# Altium project MAIN_BOARD.PrjPcb (part 3 of 3)

## Sheet JETSON.SchDoc
size E; SheetNumber: 4; SheetTotal: 10
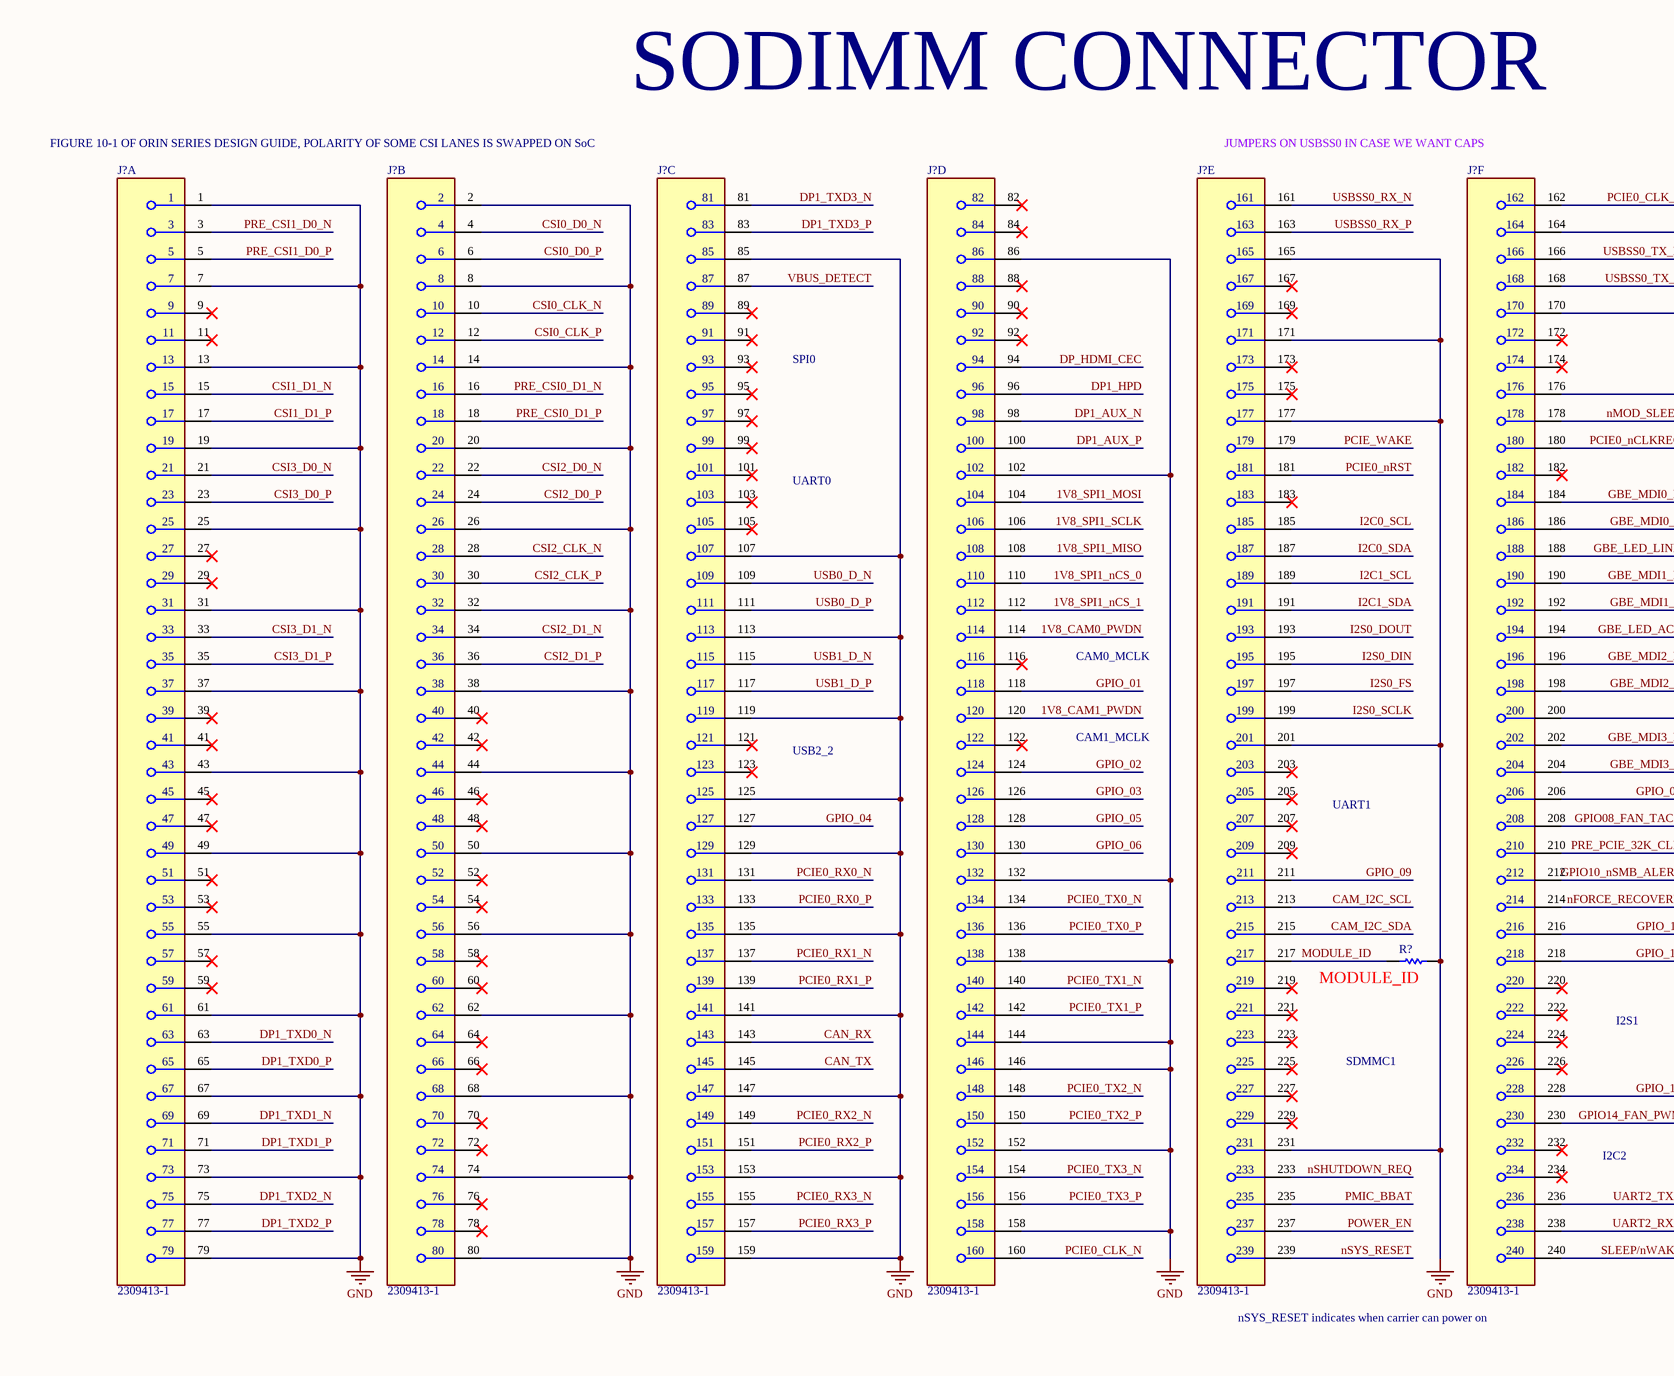
[diagram p20: JETSON.SchDoc, top left]
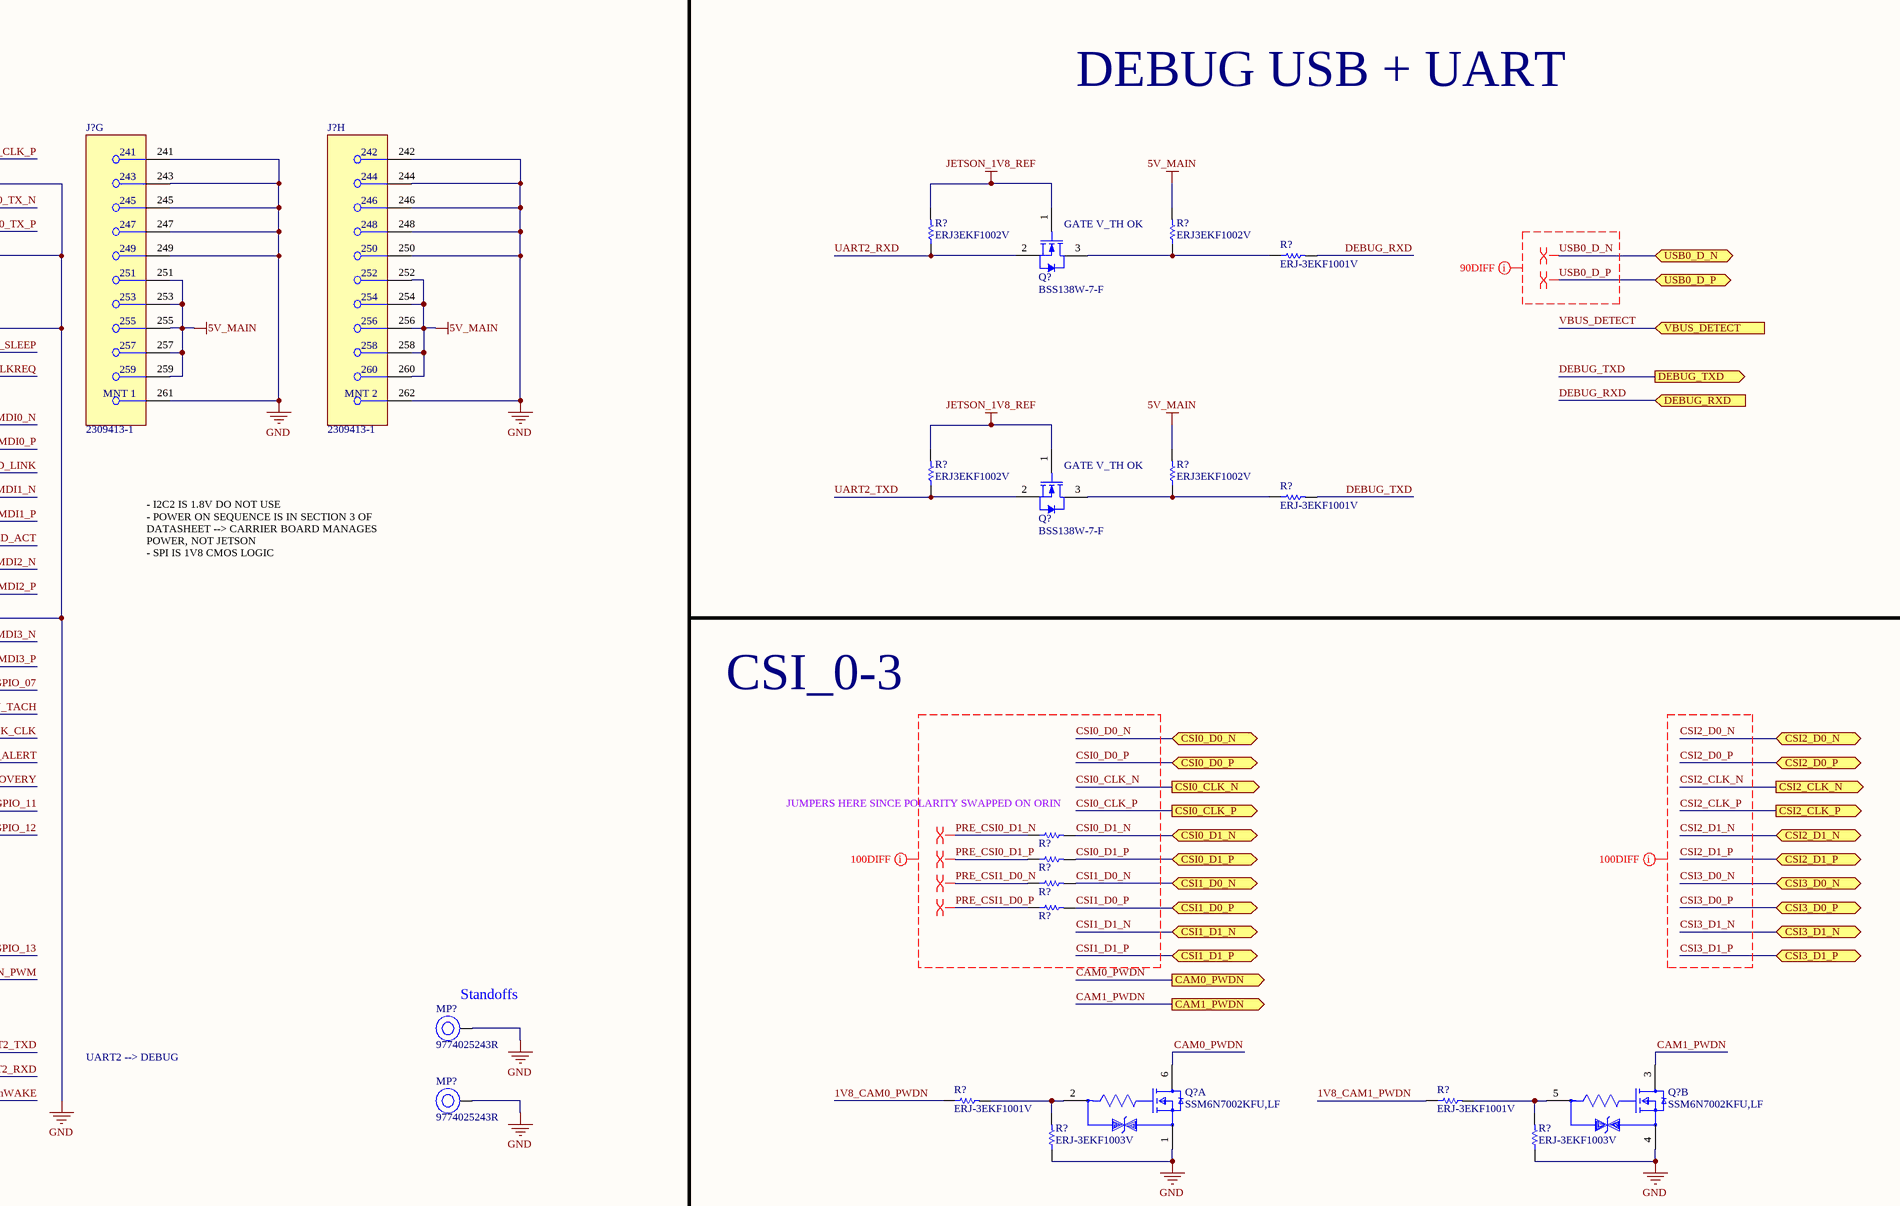
[diagram p21: JETSON.SchDoc, top middle]
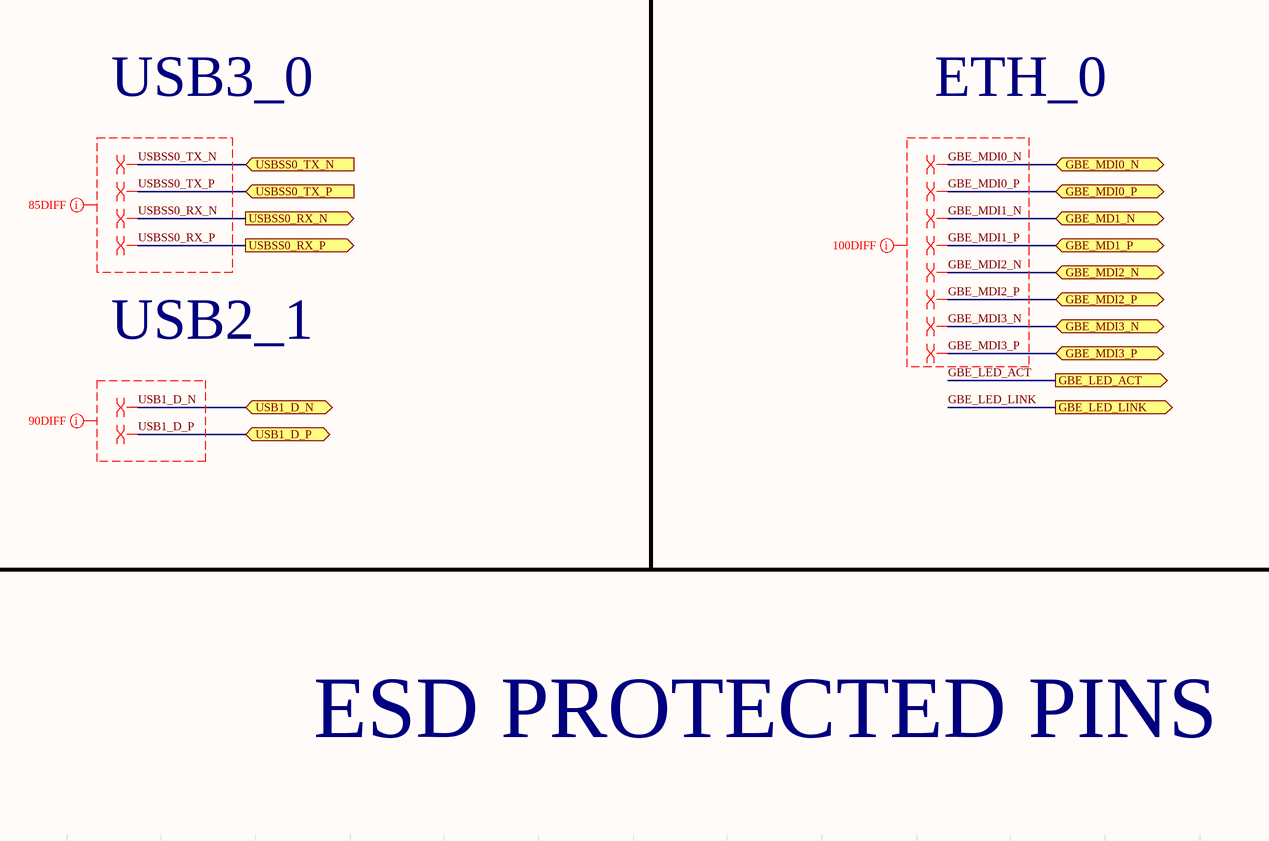
[diagram p22: JETSON.SchDoc, top right]
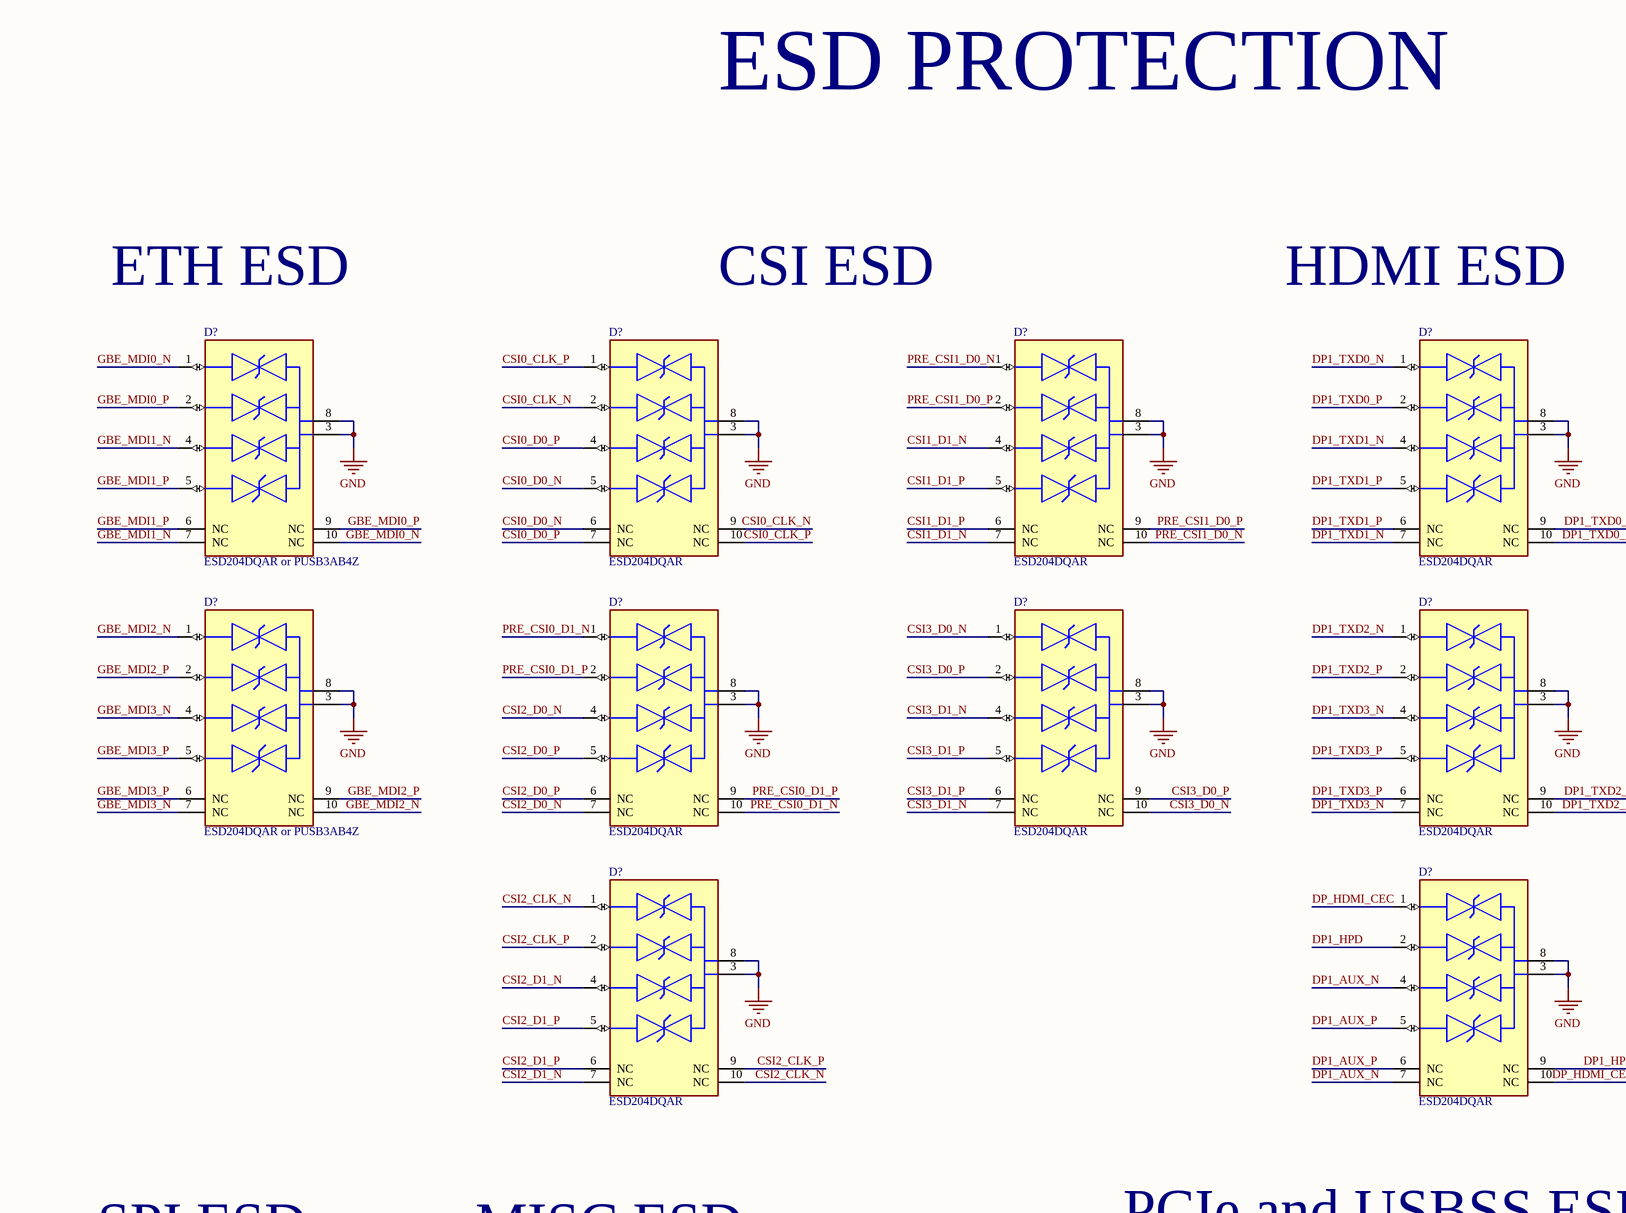
[diagram p23: JETSON.SchDoc, centre left]
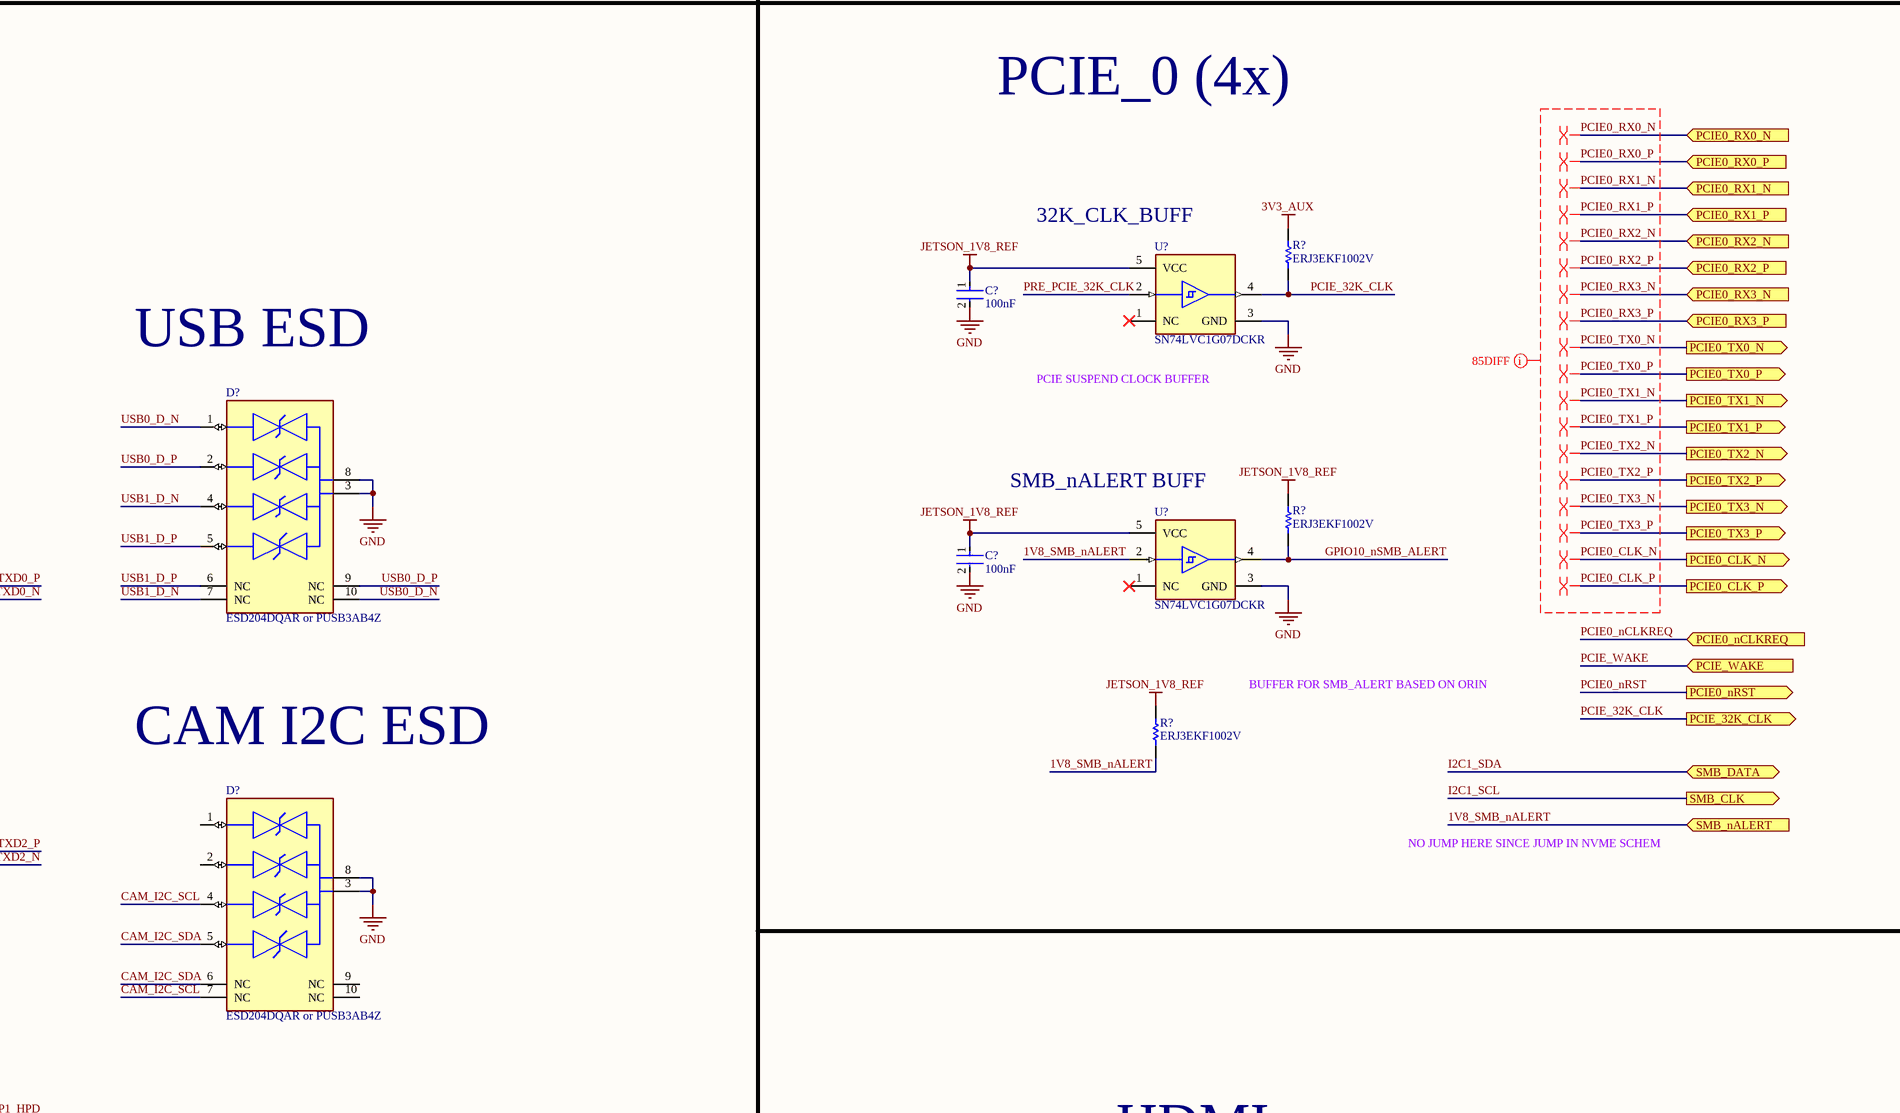
[diagram p24: JETSON.SchDoc, centre middle]
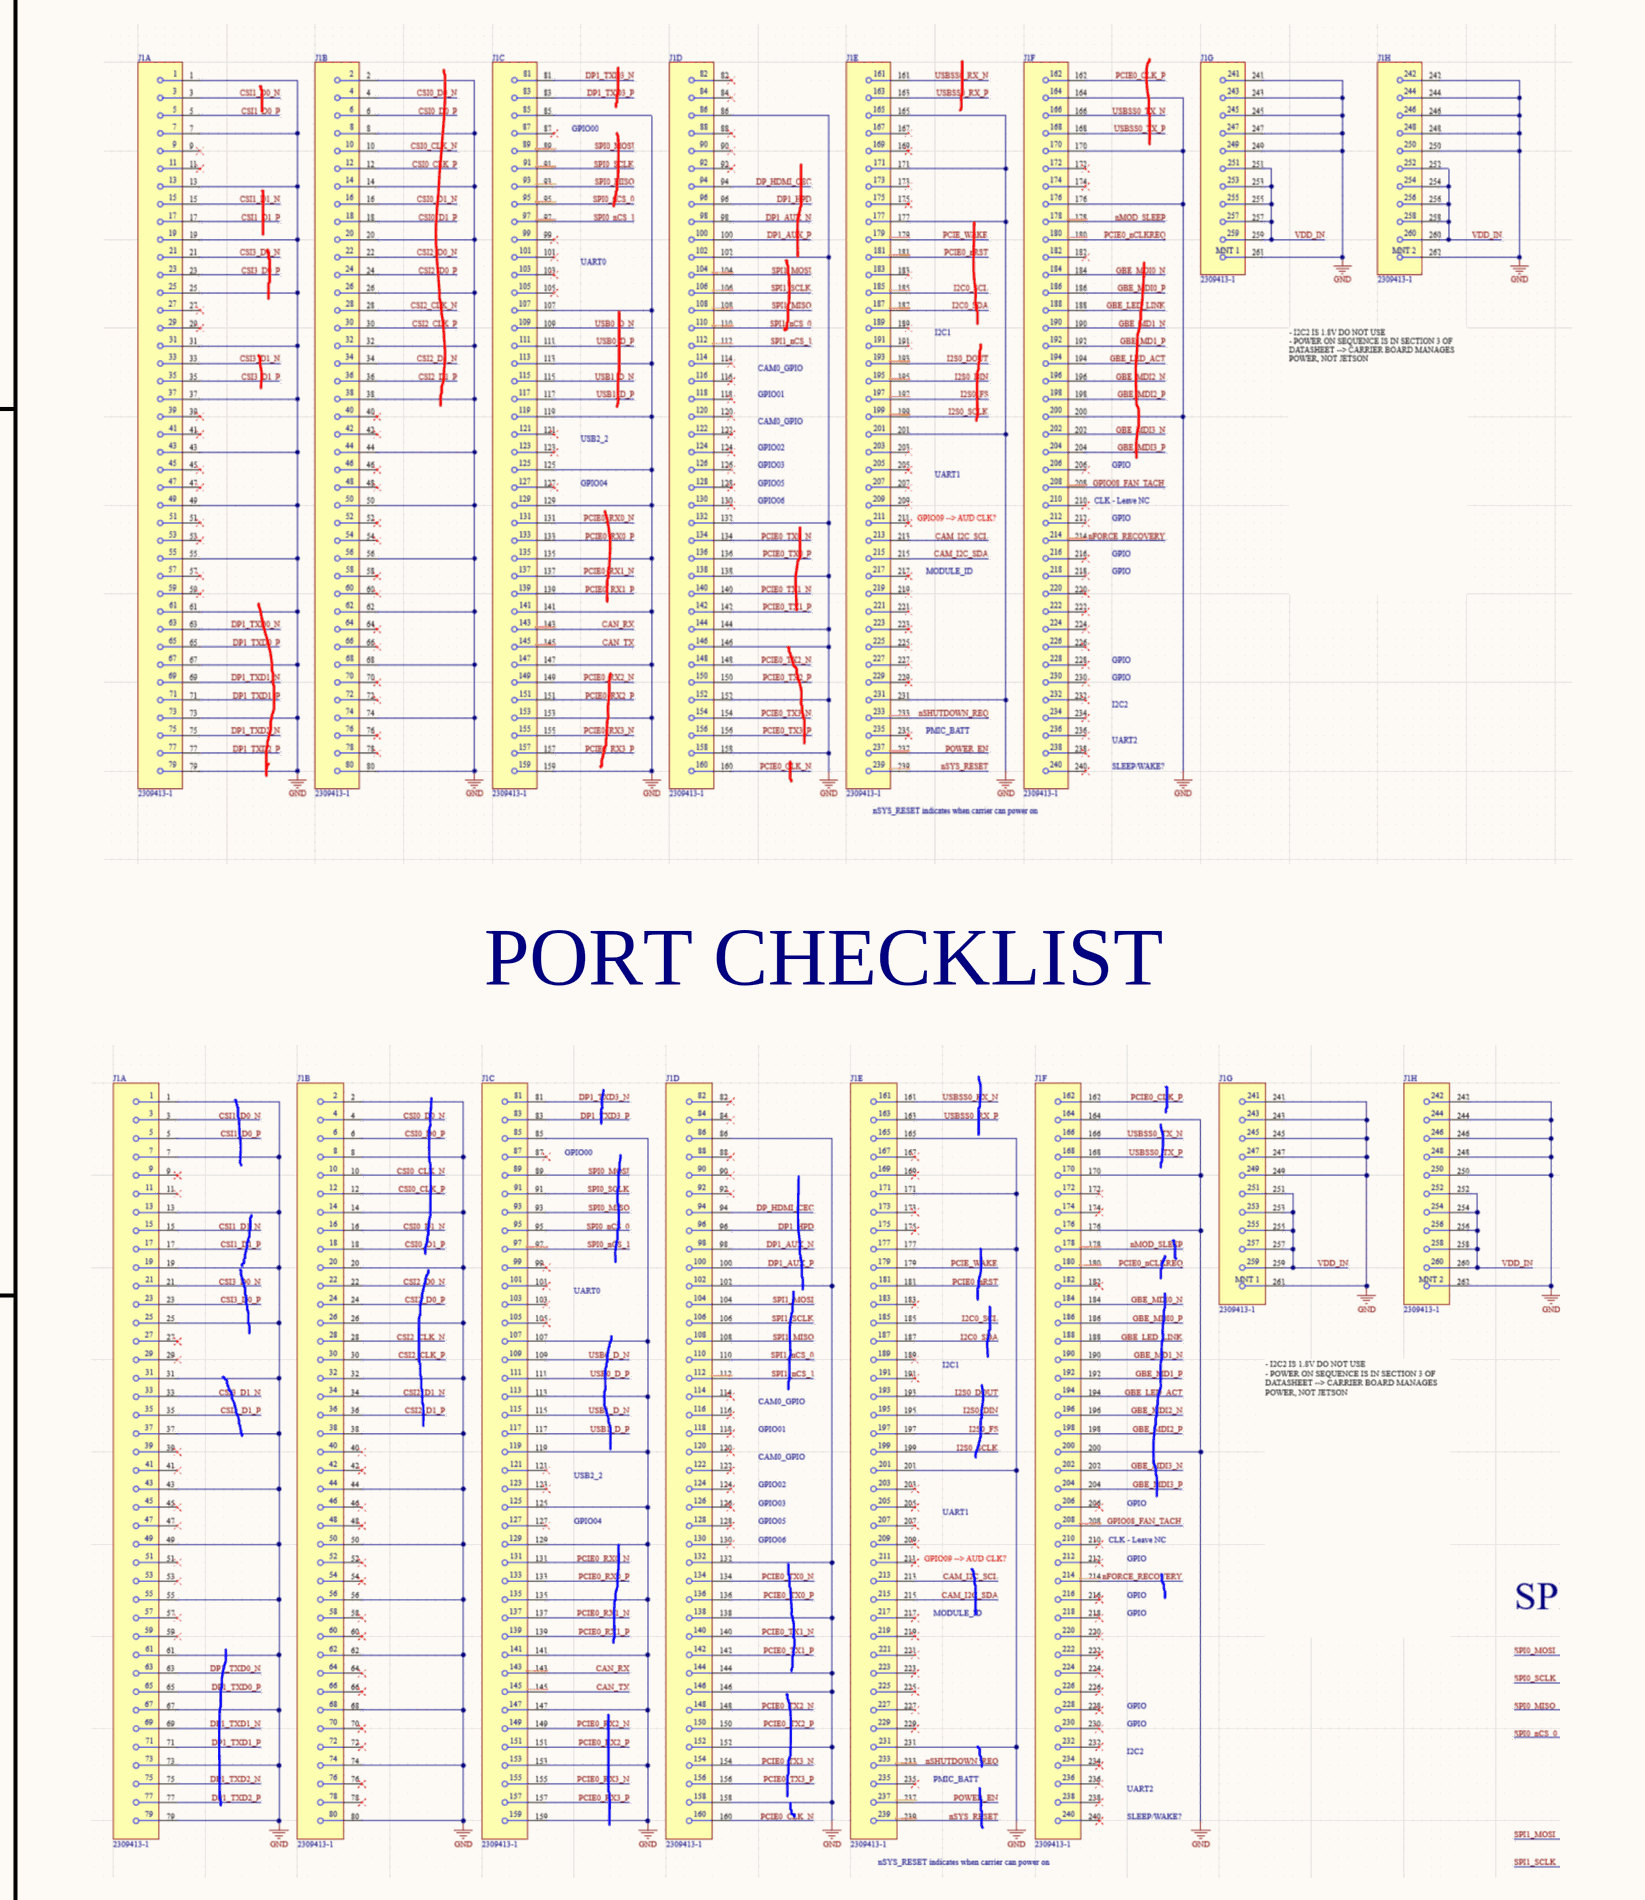
[diagram p25: JETSON.SchDoc, centre right]
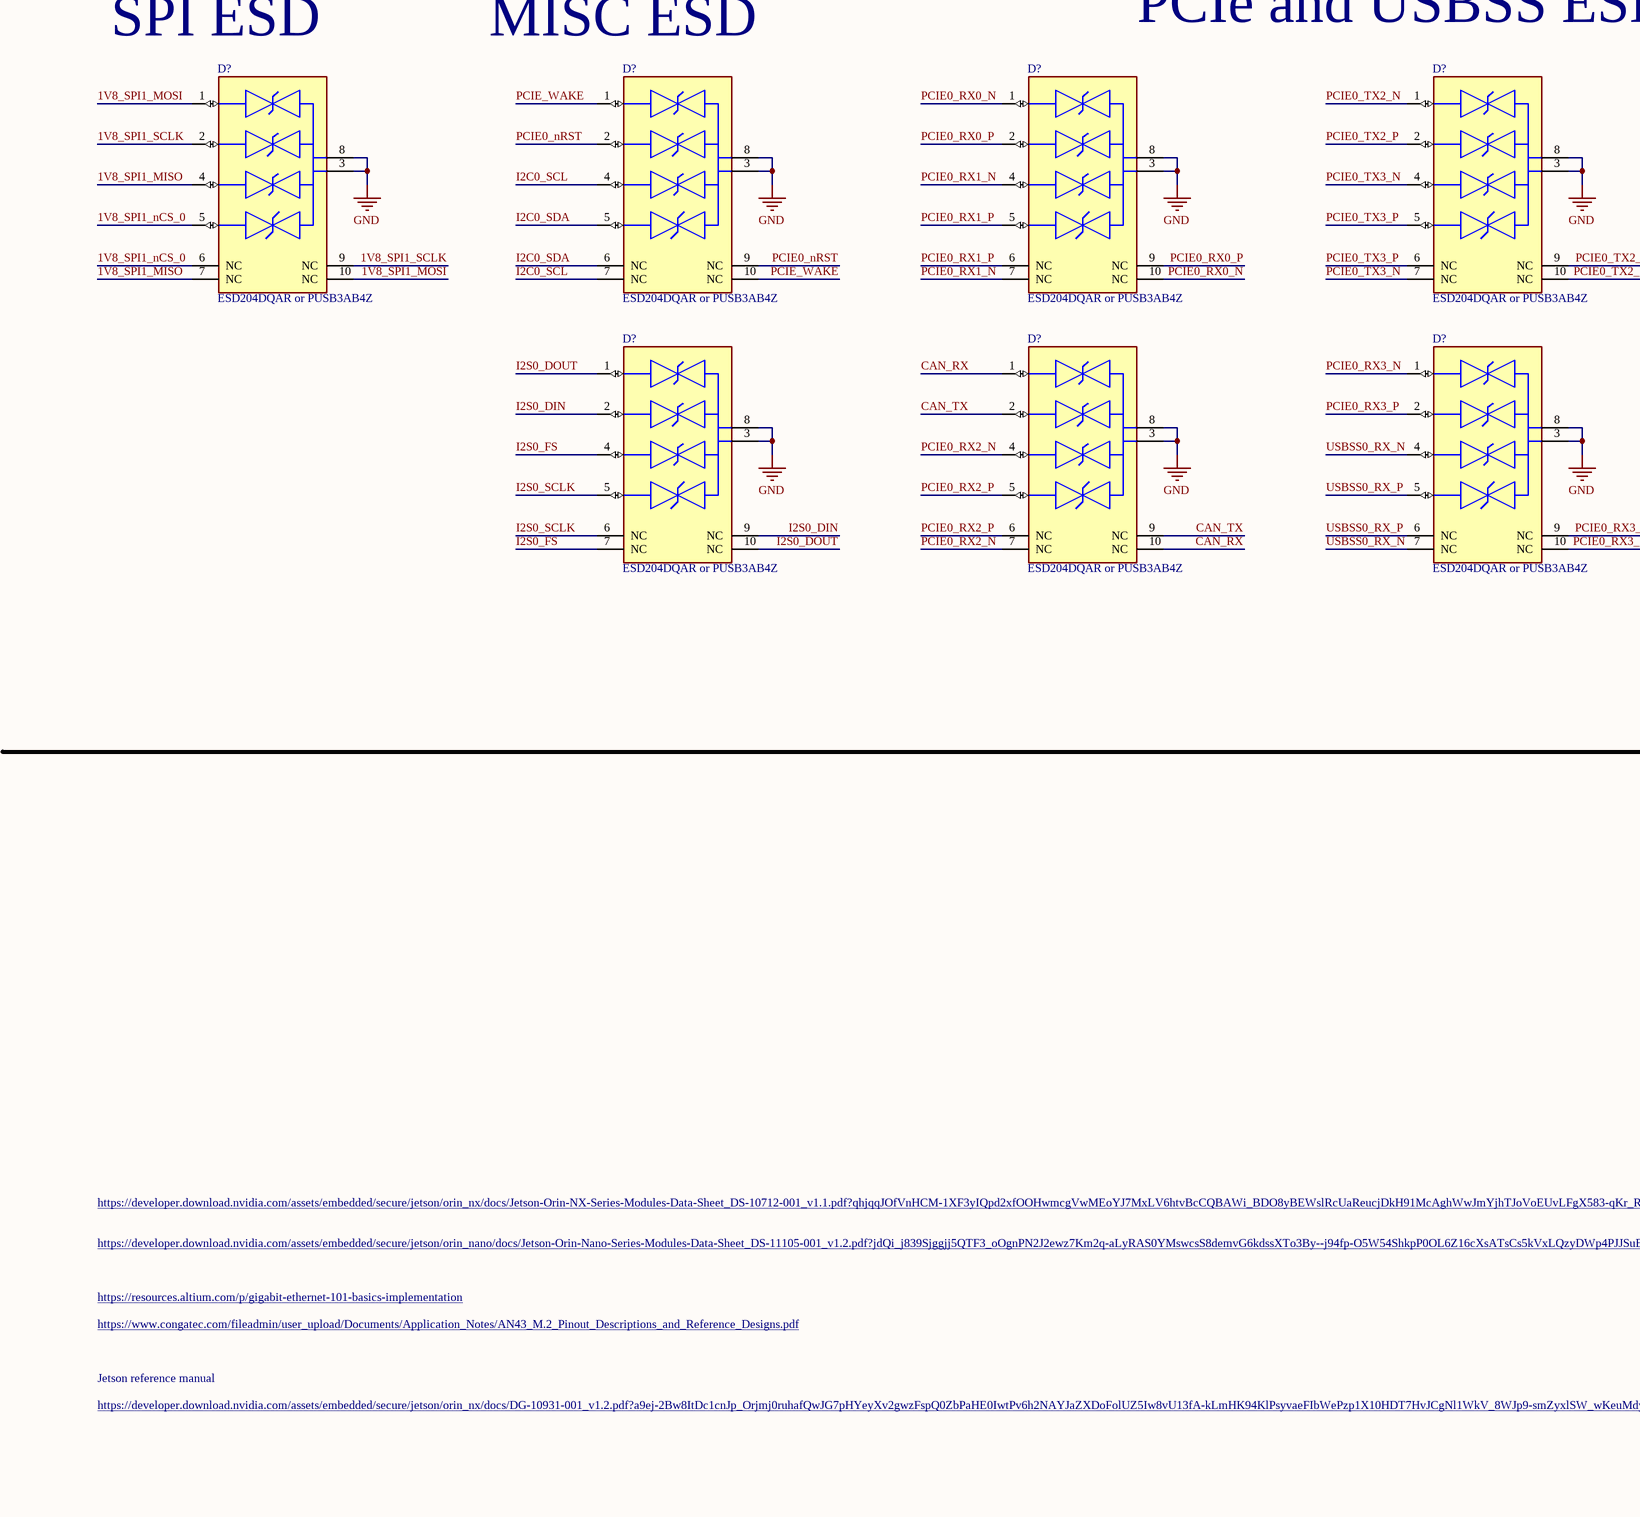
[diagram p26: JETSON.SchDoc, bottom left]
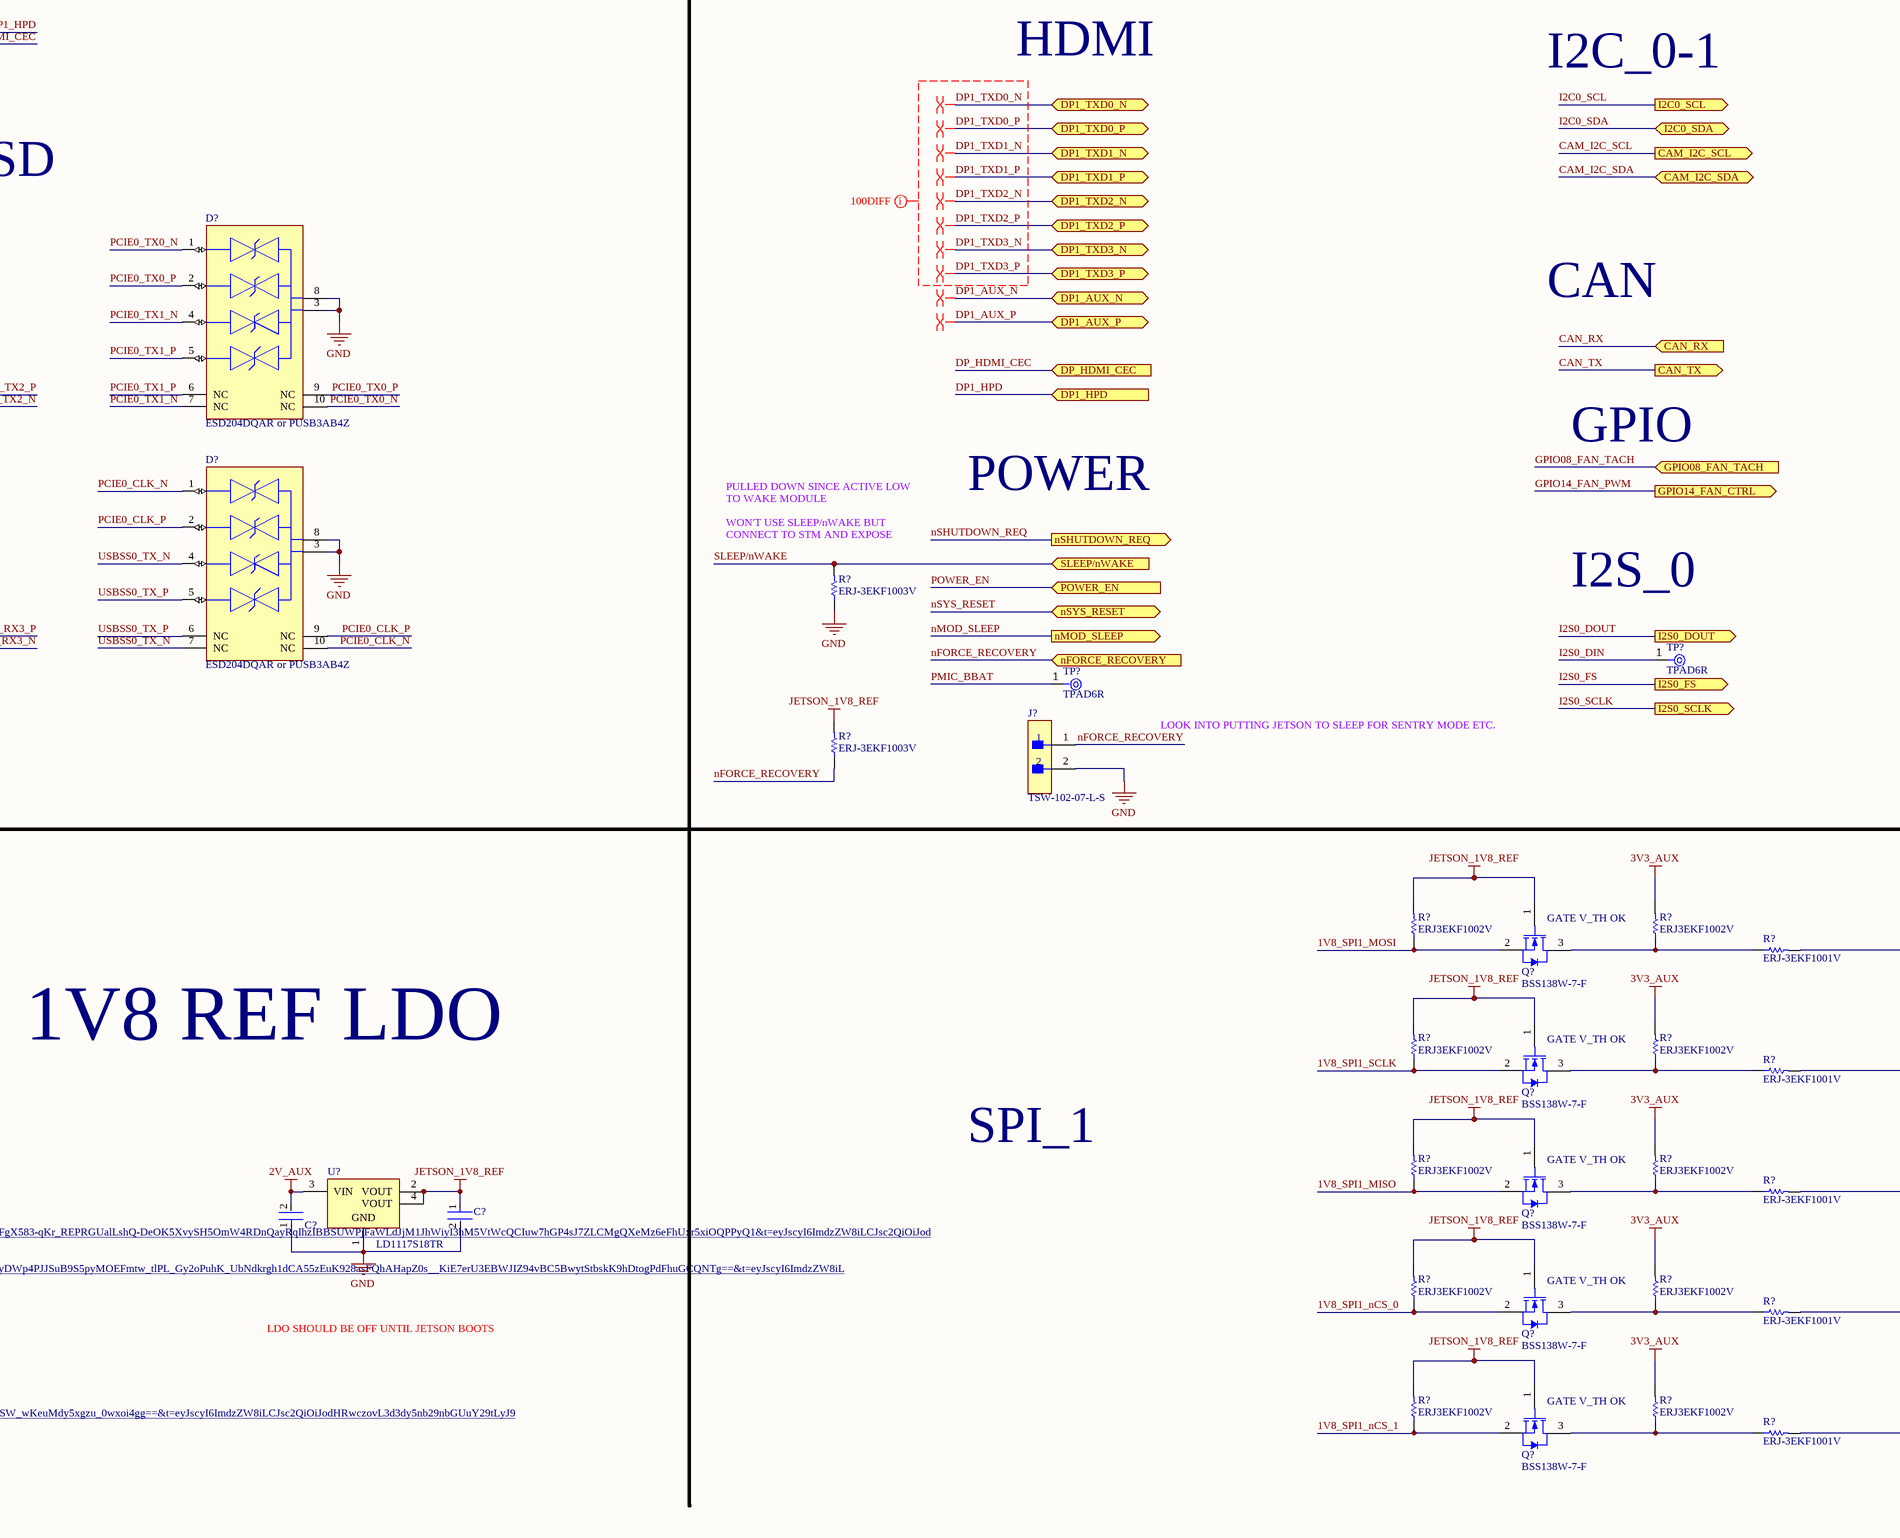
[diagram p27: JETSON.SchDoc, bottom middle]
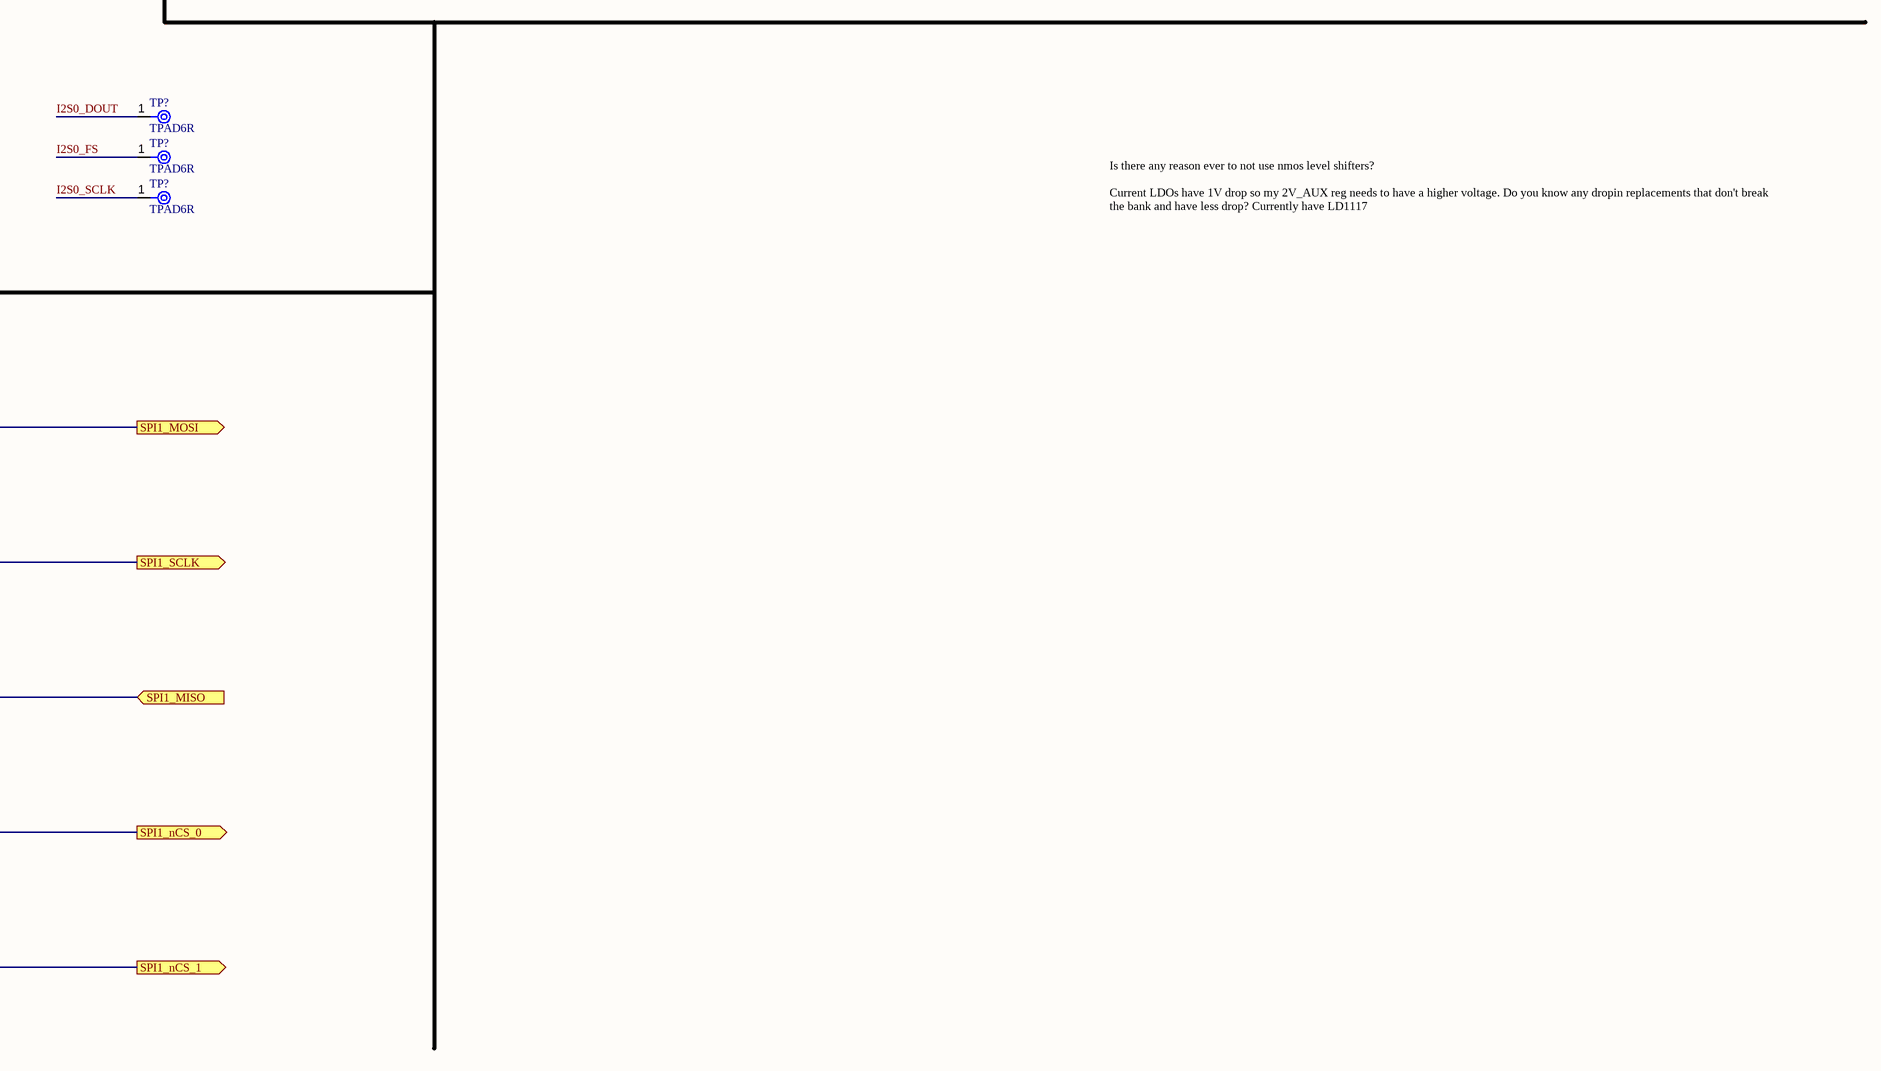
[diagram p28: JETSON.SchDoc, bottom right]

### Parts
(Parts that share a designator on the sheet are numbered #1, #2 ... from top to bottom, then left to right.)
C?#69  100nF  [FP-0402-L_1_0_0_05-W_0_5-IPC_A]
C?#70  100nF  [FP-0402-L_1_0_0_05-W_0_5-IPC_A]
C?#71  GRM188R60J106ME47D  [FP-GRM188-0_1-e0_2_0_55-IPC_A]  (value not drawn)
C?#72  C1005X7R1H104K050BB  [FP-C1005-050-0_05-IPC_C]  (value not drawn)
D?#3  ESD204DQAR or PUSB3AB4Z  [FP-DQA0010A-MFG]
D?#4  ESD204DQAR  [FP-DQA0010A-MFG]
D?#5  ESD204DQAR  [FP-DQA0010A-MFG]
D?#6  ESD204DQAR  [FP-DQA0010A-MFG]
D?#7  ESD204DQAR or PUSB3AB4Z  [FP-DQA0010A-MFG]
D?#8  ESD204DQAR or PUSB3AB4Z  [FP-DQA0010A-MFG]
D?#9  ESD204DQAR  [FP-DQA0010A-MFG]
D?#10  ESD204DQAR  [FP-DQA0010A-MFG]
D?#11  ESD204DQAR  [FP-DQA0010A-MFG]
D?#12  ESD204DQAR or PUSB3AB4Z  [FP-DQA0010A-MFG]
D?#13  ESD204DQAR  [FP-DQA0010A-MFG]
D?#14  ESD204DQAR  [FP-DQA0010A-MFG]
D?#15  ESD204DQAR or PUSB3AB4Z  [FP-DQA0010A-MFG]
D?#16  ESD204DQAR or PUSB3AB4Z  [FP-DQA0010A-MFG]
D?#17  ESD204DQAR or PUSB3AB4Z  [FP-DQA0010A-MFG]
D?#18  ESD204DQAR or PUSB3AB4Z  [FP-DQA0010A-MFG]
D?#19  ESD204DQAR or PUSB3AB4Z  [FP-DQA0010A-MFG]
D?#20  ESD204DQAR or PUSB3AB4Z  [FP-DQA0010A-MFG]
D?#21  ESD204DQAR or PUSB3AB4Z  [FP-DQA0010A-MFG]
D?#22  ESD204DQAR or PUSB3AB4Z  [FP-DQA0010A-MFG]
D?#23  ESD204DQAR or PUSB3AB4Z  [FP-DQA0010A-MFG]
J?#16  2309413-1  [FP-2309413-1-MFG]  (part A of 8)
J?#17  2309413-1  [FP-2309413-1-MFG]  (part B of 8)
J?#18  2309413-1  [FP-2309413-1-MFG]  (part C of 8)
J?#19  2309413-1  [FP-2309413-1-MFG]  (part D of 8)
J?#20  2309413-1  [FP-2309413-1-MFG]  (part E of 8)
J?#21  2309413-1  [FP-2309413-1-MFG]  (part F of 8)
J?#22  2309413-1  [FP-2309413-1-MFG]  (part G of 8)
J?#23  2309413-1  [FP-2309413-1-MFG]  (part H of 8)
J?#24  TSW-102-07-L-S  [FP-TSW-102-07-L-S-MFG]
MP?#4  9774025243R  [9774025243]
MP?#5  9774025243R  [9774025243]
Q?#6  BSS138W-7-F  [DIOD-SOT323-3_V]
Q?#7  BSS138W-7-F  [DIOD-SOT323-3_V]
Q?#8  SSM6N7002KFU,LF  [FP-SSOP6-P-0_65A-MFG]  (part A of 2)
Q?#9  SSM6N7002KFU,LF  [FP-SSOP6-P-0_65A-MFG]  (part B of 2)
Q?#10  BSS138W-7-F  [DIOD-SOT323-3_V]
Q?#11  BSS138W-7-F  [DIOD-SOT323-3_V]
Q?#12  BSS138W-7-F  [DIOD-SOT323-3_V]
Q?#13  BSS138W-7-F  [DIOD-SOT323-3_V]
Q?#14  BSS138W-7-F  [DIOD-SOT323-3_V]
R?#53  ERJ3EKF1002V  [RESC1609X55X30LL15T15]
R?#54  ERJ3EKF1002V  [RESC1609X55X30LL15T15]
R?#55  ERJ-3EKF1001V  [RESC1608X55X30LL15T15]
R?#56  ERJ3EKF1002V  [RESC1609X55X30LL15T15]
R?#57  ERJ3EKF1002V  [RESC1609X55X30LL15T15]
R?#58  ERJ-3EKF1001V  [RESC1608X55X30LL15T15]
R?#59  0402 JUMPER  [RESC1005X40X25ML05T05]  (value not drawn)
R?#60  0402 JUMPER  [RESC1005X40X25ML05T05]  (value not drawn)
R?#61  0402 JUMPER  [RESC1005X40X25ML05T05]  (value not drawn)
R?#62  0402 JUMPER  [RESC1005X40X25ML05T05]  (value not drawn)
R?#63  0402 JUMPER  [RESC1005X40X25ML05T05]  (value not drawn)
R?#64  ERJ-3EKF1001V  [RESC1608X55X30LL15T15]
R?#65  ERJ-3EKF1001V  [RESC1608X55X30LL15T15]
R?#66  ERJ-3EKF1003V  [RESC1608X55X30ML15T15]
R?#67  ERJ-3EKF1003V  [RESC1608X55X30ML15T15]
R?#68  ERJ3EKF1002V  [RESC1609X55X30LL15T15]
R?#69  ERJ3EKF1002V  [RESC1609X55X30LL15T15]
R?#70  ERJ3EKF1002V  [RESC1609X55X30LL15T15]
R?#71  ERJ-3EKF1003V  [RESC1608X55X30ML15T15]
R?#72  ERJ-3EKF1003V  [RESC1608X55X30ML15T15]
R?#73  ERJ3EKF1002V  [RESC1609X55X30LL15T15]
R?#74  ERJ3EKF1002V  [RESC1609X55X30LL15T15]
R?#75  ERJ-3EKF1001V  [RESC1608X55X30LL15T15]
R?#76  ERJ3EKF1002V  [RESC1609X55X30LL15T15]
R?#77  ERJ3EKF1002V  [RESC1609X55X30LL15T15]
R?#78  ERJ-3EKF1001V  [RESC1608X55X30LL15T15]
R?#79  ERJ3EKF1002V  [RESC1609X55X30LL15T15]
R?#80  ERJ3EKF1002V  [RESC1609X55X30LL15T15]
R?#81  ERJ-3EKF1001V  [RESC1608X55X30LL15T15]
R?#82  ERJ3EKF1002V  [RESC1609X55X30LL15T15]
R?#83  ERJ3EKF1002V  [RESC1609X55X30LL15T15]
R?#84  ERJ-3EKF1001V  [RESC1608X55X30LL15T15]
R?#85  ERJ3EKF1002V  [RESC1609X55X30LL15T15]
R?#86  ERJ3EKF1002V  [RESC1609X55X30LL15T15]
R?#87  ERJ-3EKF1001V  [RESC1608X55X30LL15T15]
TP?#4  TPAD6R  [New footprint 1]
TP?#5  TPAD6R  [New footprint 1]
TP?#6  TPAD6R  [New footprint 1]
TP?#7  TPAD6R  [New footprint 1]
TP?#8  TPAD6R  [New footprint 1]
U?#11  SN74LVC1G07DCKR  [FP-DCK0005A-IPC_C]
U?#12  SN74LVC1G07DCKR  [FP-DCK0005A-IPC_C]
U?#13  LD1117S18TR  [SOT-223_M]

### Ports
CAM0_PWDN (out), CAM1_PWDN (out), CAM_I2C_SCL (out), CAM_I2C_SDA (bidir), CAN_RX (in), CAN_TX (out), CSI0_CLK_N (out), CSI0_CLK_P (out), CSI0_D0_N (bidir), CSI0_D0_P (bidir), CSI0_D1_N (bidir), CSI0_D1_P (bidir), CSI1_D0_N (bidir), CSI1_D0_P (bidir), CSI1_D1_N (bidir), CSI1_D1_P (bidir), CSI2_CLK_N (out), CSI2_CLK_P (out), CSI2_D0_N (bidir), CSI2_D0_P (bidir), CSI2_D1_N (bidir), CSI2_D1_P (bidir), CSI3_D0_N (bidir), CSI3_D0_P (bidir), CSI3_D1_N (bidir), CSI3_D1_P (bidir), DEBUG_RXD (in), DEBUG_TXD (out), DP1_AUX_N (bidir), DP1_AUX_P (bidir), DP1_HPD (in), DP1_TXD0_N (bidir), DP1_TXD0_P (bidir), DP1_TXD1_N (bidir), DP1_TXD1_P (bidir), DP1_TXD2_N (bidir), DP1_TXD2_P (bidir), DP1_TXD3_N (bidir), DP1_TXD3_P (bidir), DP_HDMI_CEC (in), GBE_LED_ACT (out), GBE_LED_LINK (out), GBE_MD1_N (bidir), GBE_MD1_P (bidir), GBE_MDI0_N (bidir), GBE_MDI0_P (bidir), GBE_MDI2_N (bidir), GBE_MDI2_P (bidir), GBE_MDI3_N (bidir), GBE_MDI3_P (bidir), GPIO08_FAN_TACH (in), GPIO14_FAN_CTRL (out), I2C0_SCL (out), I2C0_SDA (bidir), I2S0_DOUT (out), I2S0_FS (out), I2S0_SCLK (out), nFORCE_RECOVERY (in), nMOD_SLEEP (out), nSHUTDOWN_REQ (out), nSYS_RESET (bidir), PCIE0_CLK_N (out), PCIE0_CLK_P (out), PCIE0_nCLKREQ (in), PCIE0_nRST (out), PCIE0_RX0_N (in), PCIE0_RX0_P (in), PCIE0_RX1_N (in), PCIE0_RX1_P (in), PCIE0_RX2_N (in), PCIE0_RX2_P (in), PCIE0_RX3_N (in), PCIE0_RX3_P (in), PCIE0_TX0_N (out), PCIE0_TX0_P (out), PCIE0_TX1_N (out), PCIE0_TX1_P (out), PCIE0_TX2_N (out), PCIE0_TX2_P (out), PCIE0_TX3_N (out), PCIE0_TX3_P (out), PCIE_32K_CLK (out), PCIE_WAKE (in), POWER_EN (in), SLEEP/nWAKE (in), SMB_CLK (out), SMB_DATA (bidir), SMB_nALERT (in), SPI1_MISO (in), SPI1_MOSI (out), SPI1_nCS_0 (out), SPI1_nCS_1 (out), SPI1_SCLK (out), USB0_D_N (bidir), USB0_D_P (bidir), USB1_D_N (bidir), USB1_D_P (bidir), USBSS0_RX_N (out), USBSS0_RX_P (out), USBSS0_TX_N (in), USBSS0_TX_P (in), VBUS_DETECT (in)

### Nets
2V_AUX: C?#72.2 U?#13.3(VIN)  [project net RAIL]
3V3_AUX: R?#68.2 R?#74.2 R?#77.2 R?#80.2 R?#83.2 R?#86.2  [project net RAIL]
5V_MAIN: J?#22.251 J?#22.253 J?#22.255 J?#22.257 J?#22.259 J?#23.252 J?#23.254 J?#23.256 J?#23.258 J?#23.260 R?#54.2 R?#57.2
GND: C?#69.2 C?#70.2 C?#71.2 C?#72.1 D?#3.3(GND) D?#3.8(GND) D?#4.3(GND) D?#4.8(GND) D?#5.3(GND) D?#5.8(GND) D?#6.3(GND) D?#6.8(GND) D?#7.3(GND) D?#7.8(GND) D?#8.3(GND) D?#8.8(GND) D?#9.3(GND) D?#9.8(GND) D?#10.3(GND) D?#10.8(GND) D?#11.3(GND) D?#11.8(GND) D?#12.3(GND) D?#12.8(GND) D?#13.3(GND) D?#13.8(GND) D?#14.3(GND) D?#14.8(GND) D?#15.3(GND) D?#15.8(GND) D?#16.3(GND) D?#16.8(GND) D?#17.3(GND) D?#17.8(GND) D?#18.3(GND) D?#18.8(GND) D?#19.3(GND) D?#19.8(GND) D?#20.3(GND) D?#20.8(GND) D?#21.3(GND) D?#21.8(GND) D?#22.3(GND) D?#22.8(GND) D?#23.3(GND) D?#23.8(GND) J?#16.1 J?#16.7 J?#16.13 J?#16.19 J?#16.25 J?#16.31 J?#16.37 J?#16.43 J?#16.49 J?#16.55 J?#16.61 J?#16.67 J?#16.73 J?#16.79 J?#17.2 J?#17.8 J?#17.14 J?#17.20 J?#17.26 J?#17.32 J?#17.38 J?#17.44 J?#17.50 J?#17.56 J?#17.62 J?#17.68 J?#17.74 J?#17.80 J?#18.85 J?#18.107 J?#18.113 J?#18.119 J?#18.125 J?#18.129 J?#18.135 J?#18.141 J?#18.147 J?#18.153 J?#18.159 J?#19.86 J?#19.102 J?#19.132 J?#19.138 J?#19.144 J?#19.146 J?#19.152 J?#19.158 J?#20.165 J?#20.171 J?#20.177 J?#20.201 J?#20.231 J?#21.164 J?#21.170 J?#21.176 J?#21.200 J?#22.241 J?#22.243 J?#22.245 J?#22.247 J?#22.249 J?#22.261(MNT_1) J?#23.242 J?#23.244 J?#23.246 J?#23.248 J?#23.250 J?#23.262(MNT_2) J?#24.2 MP?#4.1 MP?#5.1 Q?#8.1(Source1) Q?#9.4(Source2) R?#59.2 R?#66.1 R?#67.1 R?#71.1 U?#11.3(GND) U?#12.3(GND) U?#13.1(GND)
JETSON_1V8_REF: C?#69.1 C?#70.1 C?#71.1 Q?#6.1(G) Q?#7.1(G) Q?#10.1(G) Q?#11.1(G) Q?#12.1(G) Q?#13.1(G) Q?#14.1(G) R?#53.2 R?#56.2 R?#69.2 R?#70.2 R?#72.2 R?#73.2 R?#76.2 R?#79.2 R?#82.2 R?#85.2 U?#11.5(VCC) U?#12.5(VCC) U?#13.2(VOUT) U?#13.4(VOUT)
1V8_CAM0_PWDN: J?#19.114 R?#64.1
1V8_CAM1_PWDN: J?#19.120 R?#65.1
1V8_SMB_nALERT: R?#70.1 U?#12.2(A) ; port SMB_nALERT
1V8_SPI1_MISO: D?#15.4(IO3) D?#15.7(NC) J?#19.108 Q?#12.2(S) R?#79.1
1V8_SPI1_MOSI: D?#15.1(IO1) D?#15.10(NC) J?#19.104 Q?#10.2(S) R?#73.1
1V8_SPI1_nCS_0: D?#15.5(IO4) D?#15.6(NC) J?#19.110 Q?#13.2(S) R?#82.1
1V8_SPI1_nCS_1: J?#19.112 Q?#14.2(S) R?#85.1
1V8_SPI1_SCLK: D?#15.2(IO2) D?#15.9(NC) J?#19.106 Q?#11.2(S) R?#76.1
CAM0_PWDN: Q?#8.6(Drain1) ; port CAM0_PWDN
CAM1_PWDN: Q?#9.3(Drain2) ; port CAM1_PWDN
CAM_I2C_SCL: D?#12.4(IO3) D?#12.7(NC) J?#20.213 ; port CAM_I2C_SCL
CAM_I2C_SDA: D?#12.5(IO4) D?#12.6(NC) J?#20.215 ; port CAM_I2C_SDA
CAN_RX: D?#21.1(IO1) D?#21.10(NC) J?#18.143 ; port CAN_RX
CAN_TX: D?#21.2(IO2) D?#21.9(NC) J?#18.145 ; port CAN_TX
CSI0_CLK_N: D?#4.2(IO2) D?#4.9(NC) J?#17.10 ; port CSI0_CLK_N
CSI0_CLK_P: D?#4.1(IO1) D?#4.10(NC) J?#17.12 ; port CSI0_CLK_P
CSI0_D0_N: D?#4.5(IO4) D?#4.6(NC) J?#17.4 ; port CSI0_D0_N
CSI0_D0_P: D?#4.4(IO3) D?#4.7(NC) J?#17.6 ; port CSI0_D0_P
CSI0_D1_N: R?#60.2 ; port CSI0_D1_N
CSI0_D1_P: R?#61.2 ; port CSI0_D1_P
CSI1_D0_N: R?#62.2 ; port CSI1_D0_N
CSI1_D0_P: R?#63.2 ; port CSI1_D0_P
CSI1_D1_N: D?#5.4(IO3) D?#5.7(NC) J?#16.15 ; port CSI1_D1_N
CSI1_D1_P: D?#5.5(IO4) D?#5.6(NC) J?#16.17 ; port CSI1_D1_P
CSI2_CLK_N: D?#13.1(IO1) D?#13.10(NC) J?#17.28 ; port CSI2_CLK_N
CSI2_CLK_P: D?#13.2(IO2) D?#13.9(NC) J?#17.30 ; port CSI2_CLK_P
CSI2_D0_N: D?#9.4(IO3) D?#9.7(NC) J?#17.22 ; port CSI2_D0_N
CSI2_D0_P: D?#9.5(IO4) D?#9.6(NC) J?#17.24 ; port CSI2_D0_P
CSI2_D1_N: D?#13.4(IO3) D?#13.7(NC) J?#17.34 ; port CSI2_D1_N
CSI2_D1_P: D?#13.5(IO4) D?#13.6(NC) J?#17.36 ; port CSI2_D1_P
CSI3_D0_N: D?#10.1(IO1) D?#10.10(NC) J?#16.21 ; port CSI3_D0_N
CSI3_D0_P: D?#10.2(IO2) D?#10.9(NC) J?#16.23 ; port CSI3_D0_P
CSI3_D1_N: D?#10.4(IO3) D?#10.7(NC) J?#16.33 ; port CSI3_D1_N
CSI3_D1_P: D?#10.5(IO4) D?#10.6(NC) J?#16.35 ; port CSI3_D1_P
DEBUG_RXD: R?#55.2 ; port DEBUG_RXD
DEBUG_TXD: R?#58.2 ; port DEBUG_TXD
DP1_AUX_N: D?#14.4(IO3) D?#14.7(NC) J?#19.98 ; port DP1_AUX_N
DP1_AUX_P: D?#14.5(IO4) D?#14.6(NC) J?#19.100 ; port DP1_AUX_P
DP1_HPD: D?#14.2(IO2) D?#14.9(NC) J?#19.96 ; port DP1_HPD
DP1_TXD0_N: D?#6.1(IO1) D?#6.10(NC) J?#16.63 ; port DP1_TXD0_N
DP1_TXD0_P: D?#6.2(IO2) D?#6.9(NC) J?#16.65 ; port DP1_TXD0_P
DP1_TXD1_N: D?#6.4(IO3) D?#6.7(NC) J?#16.69 ; port DP1_TXD1_N
DP1_TXD1_P: D?#6.5(IO4) D?#6.6(NC) J?#16.71 ; port DP1_TXD1_P
DP1_TXD2_N: D?#11.1(IO1) D?#11.10(NC) J?#16.75 ; port DP1_TXD2_N
DP1_TXD2_P: D?#11.2(IO2) D?#11.9(NC) J?#16.77 ; port DP1_TXD2_P
DP1_TXD3_N: D?#11.4(IO3) D?#11.7(NC) J?#18.81 ; port DP1_TXD3_N
DP1_TXD3_P: D?#11.5(IO4) D?#11.6(NC) J?#18.83 ; port DP1_TXD3_P
DP_HDMI_CEC: D?#14.1(IO1) D?#14.10(NC) J?#19.94 ; port DP_HDMI_CEC
GBE_LED_ACT: J?#21.194 ; port GBE_LED_ACT
GBE_LED_LINK: J?#21.188 ; port GBE_LED_LINK
GBE_MDI0_N: D?#3.1(IO1) D?#3.10(NC) J?#21.184 ; port GBE_MDI0_N
GBE_MDI0_P: D?#3.2(IO2) D?#3.9(NC) J?#21.186 ; port GBE_MDI0_P
GBE_MDI1_N: D?#3.4(IO3) D?#3.7(NC) J?#21.190 ; port GBE_MD1_N
GBE_MDI1_P: D?#3.5(IO4) D?#3.6(NC) J?#21.192 ; port GBE_MD1_P
GBE_MDI2_N: D?#8.1(IO1) D?#8.10(NC) J?#21.196 ; port GBE_MDI2_N
GBE_MDI2_P: D?#8.2(IO2) D?#8.9(NC) J?#21.198 ; port GBE_MDI2_P
GBE_MDI3_N: D?#8.4(IO3) D?#8.7(NC) J?#21.202 ; port GBE_MDI3_N
GBE_MDI3_P: D?#8.5(IO4) D?#8.6(NC) J?#21.204 ; port GBE_MDI3_P
GPIO08_FAN_TACH: J?#21.208 ; port GPIO08_FAN_TACH
GPIO10_nSMB_ALERT: J?#21.212 R?#69.1 U?#12.4(Y)
GPIO14_FAN_PWM: J?#21.230 ; port GPIO14_FAN_CTRL
GPIO_01: J?#19.118
GPIO_02: J?#19.124
GPIO_03: J?#19.126
GPIO_04: J?#18.127
GPIO_05: J?#19.128
GPIO_06: J?#19.130
GPIO_07: J?#21.206
GPIO_09: J?#20.211
GPIO_11: J?#21.216
GPIO_12: J?#21.218
GPIO_13: J?#21.228
I2C0_SCL: D?#16.4(IO3) D?#16.7(NC) J?#20.185 ; port I2C0_SCL
I2C0_SDA: D?#16.5(IO4) D?#16.6(NC) J?#20.187 ; port I2C0_SDA
I2C1_SCL: J?#20.189 ; port SMB_CLK
I2C1_SDA: J?#20.191 ; port SMB_DATA
I2S0_DIN: D?#20.2(IO2) D?#20.9(NC) J?#20.195 TP?#4.1(TP)
I2S0_DOUT: D?#20.1(IO1) D?#20.10(NC) J?#20.193 TP?#5.1(TP) ; port I2S0_DOUT
I2S0_FS: D?#20.4(IO3) D?#20.7(NC) J?#20.197 TP?#7.1(TP) ; port I2S0_FS
I2S0_SCLK: D?#20.5(IO4) D?#20.6(NC) J?#20.199 TP?#8.1(TP) ; port I2S0_SCLK
MODULE_ID: J?#20.217 R?#59.1
nFORCE_RECOVERY: J?#21.214 J?#24.1 R?#72.1 ; port nFORCE_RECOVERY
nMOD_SLEEP: J?#21.178 ; port nMOD_SLEEP
nSHUTDOWN_REQ: J?#20.233 ; port nSHUTDOWN_REQ
nSYS_RESET: J?#20.239 ; port nSYS_RESET
PCIE0_CLK_N: D?#23.1(IO1) D?#23.10(NC) J?#19.160 ; port PCIE0_CLK_N
PCIE0_CLK_P: D?#23.2(IO2) D?#23.9(NC) J?#21.162 ; port PCIE0_CLK_P
PCIE0_nCLKREQ: J?#21.180 ; port PCIE0_nCLKREQ
PCIE0_nRST: D?#16.2(IO2) D?#16.9(NC) J?#20.181 ; port PCIE0_nRST
PCIE0_RX0_N: D?#17.1(IO1) D?#17.10(NC) J?#18.131 ; port PCIE0_RX0_N
PCIE0_RX0_P: D?#17.2(IO2) D?#17.9(NC) J?#18.133 ; port PCIE0_RX0_P
PCIE0_RX1_N: D?#17.4(IO3) D?#17.7(NC) J?#18.137 ; port PCIE0_RX1_N
PCIE0_RX1_P: D?#17.5(IO4) D?#17.6(NC) J?#18.139 ; port PCIE0_RX1_P
PCIE0_RX2_N: D?#21.4(IO3) D?#21.7(NC) J?#18.149 ; port PCIE0_RX2_N
PCIE0_RX2_P: D?#21.5(IO4) D?#21.6(NC) J?#18.151 ; port PCIE0_RX2_P
PCIE0_RX3_N: D?#22.1(IO1) D?#22.10(NC) J?#18.155 ; port PCIE0_RX3_N
PCIE0_RX3_P: D?#22.2(IO2) D?#22.9(NC) J?#18.157 ; port PCIE0_RX3_P
PCIE0_TX0_N: D?#19.1(IO1) D?#19.10(NC) J?#19.134 ; port PCIE0_TX0_N
PCIE0_TX0_P: D?#19.2(IO2) D?#19.9(NC) J?#19.136 ; port PCIE0_TX0_P
PCIE0_TX1_N: D?#19.4(IO3) D?#19.7(NC) J?#19.140 ; port PCIE0_TX1_N
PCIE0_TX1_P: D?#19.5(IO4) D?#19.6(NC) J?#19.142 ; port PCIE0_TX1_P
PCIE0_TX2_N: D?#18.1(IO1) D?#18.10(NC) J?#19.148 ; port PCIE0_TX2_N
PCIE0_TX2_P: D?#18.2(IO2) D?#18.9(NC) J?#19.150 ; port PCIE0_TX2_P
PCIE0_TX3_N: D?#18.4(IO3) D?#18.7(NC) J?#19.154 ; port PCIE0_TX3_N
PCIE0_TX3_P: D?#18.5(IO4) D?#18.6(NC) J?#19.156 ; port PCIE0_TX3_P
PCIE_32K_CLK: R?#68.1 U?#11.4(Y) ; port PCIE_32K_CLK
PCIE_WAKE: D?#16.1(IO1) D?#16.10(NC) J?#20.179 ; port PCIE_WAKE
PMIC_BBAT: J?#20.235 TP?#6.1(TP)
POWER_EN: J?#20.237 ; port POWER_EN
PRE_CSI0_D1_N: D?#9.1(IO1) D?#9.10(NC) J?#17.16 R?#60.1
PRE_CSI0_D1_P: D?#9.2(IO2) D?#9.9(NC) J?#17.18 R?#61.1
PRE_CSI1_D0_N: D?#5.1(IO1) D?#5.10(NC) J?#16.3 R?#62.1
PRE_CSI1_D0_P: D?#5.2(IO2) D?#5.9(NC) J?#16.5 R?#63.1
PRE_PCIE_32K_CLK: J?#21.210 U?#11.2(A)
SLEEP/nWAKE: J?#21.240 R?#71.2 ; port SLEEP/nWAKE
UART2_RXD: J?#21.238 Q?#6.2(S) R?#53.1
UART2_TXD: J?#21.236 Q?#7.2(S) R?#56.1
USB0_D_N: D?#7.1(IO1) D?#7.10(NC) J?#18.109 ; port USB0_D_N
USB0_D_P: D?#7.2(IO2) D?#7.9(NC) J?#18.111 ; port USB0_D_P
USB1_D_N: D?#7.4(IO3) D?#7.7(NC) J?#18.115 ; port USB1_D_N
USB1_D_P: D?#7.5(IO4) D?#7.6(NC) J?#18.117 ; port USB1_D_P
USBSS0_RX_N: D?#22.4(IO3) D?#22.7(NC) J?#20.161 ; port USBSS0_RX_N
USBSS0_RX_P: D?#22.5(IO4) D?#22.6(NC) J?#20.163 ; port USBSS0_RX_P
USBSS0_TX_N: D?#23.4(IO3) D?#23.7(NC) J?#21.166 ; port USBSS0_TX_N
USBSS0_TX_P: D?#23.5(IO4) D?#23.6(NC) J?#21.168 ; port USBSS0_TX_P
VBUS_DETECT: J?#18.87 ; port VBUS_DETECT
NetQ?#6_3: Q?#6.3(D) R?#54.1 R?#55.1
NetQ?#7_3: Q?#7.3(D) R?#57.1 R?#58.1
NetQ?#8_2: Q?#8.2(Gate1) R?#64.2 R?#66.2
NetQ?#9_5: Q?#9.5(Gate2) R?#65.2 R?#67.2
NetQ?#10_3: Q?#10.3(D) R?#74.1 R?#75.1
NetQ?#11_3: Q?#11.3(D) R?#77.1 R?#78.1
NetQ?#12_3: Q?#12.3(D) R?#80.1 R?#81.1
NetQ?#13_3: Q?#13.3(D) R?#83.1 R?#84.1
NetQ?#14_3: Q?#14.3(D) R?#86.1 R?#87.1
NetR?#75_2: R?#75.2 ; port SPI1_MOSI
NetR?#78_2: R?#78.2 ; port SPI1_SCLK
NetR?#81_2: R?#81.2 ; port SPI1_MISO
NetR?#84_2: R?#84.2 ; port SPI1_nCS_0
NetR?#87_2: R?#87.2 ; port SPI1_nCS_1

Not connected (* = marked no-connect by the designer): D?#12 1(IO1) 2(IO2) 9(NC) 10(NC); J?#16 9* 11* 27* 29* 39* 41* 45* 47* 51* 53* 57* 59*; J?#17 40* 42* 46* 48* 52* 54* 58* 60* 64* 66* 70* 72* 76* 78*; J?#18 89* 91* 93* 95* 97* 99* 101* 103* 105* 121* 123*; J?#19 82* 84* 88* 90* 92* 116* 122*; J?#20 167* 169* 173* 175* 183* 203* 205* 207* 209* 219* 221* 223* 225* 227* 229*; J?#21 172* 174* 182* 220* 222* 224* 226* 232* 234*; U?#11 1(NC)*; U?#12 1(NC)*

### Layout directives
net class 85DIFF: PCIE0_CLK_N, PCIE0_CLK_P, PCIE0_RX0_N, PCIE0_RX0_P, PCIE0_RX1_N, PCIE0_RX1_P, PCIE0_RX2_N, PCIE0_RX2_P, PCIE0_RX3_N, PCIE0_RX3_P, PCIE0_TX0_N, PCIE0_TX0_P, PCIE0_TX1_N, PCIE0_TX1_P, PCIE0_TX2_N, PCIE0_TX2_P, PCIE0_TX3_N, PCIE0_TX3_P, USBSS0_RX_N, USBSS0_RX_P, USBSS0_TX_N, USBSS0_TX_P
net class 90DIFF: USB0_D_N, USB0_D_P, USB1_D_N, USB1_D_P
differential pair; differential pair class 85DIFF: PCIE0_CLK_N, PCIE0_CLK_P, PCIE0_RX0_N, PCIE0_RX0_P, PCIE0_RX1_N, PCIE0_RX1_P, PCIE0_RX2_N, PCIE0_RX2_P, PCIE0_RX3_N, PCIE0_RX3_P, PCIE0_TX0_N, PCIE0_TX0_P, PCIE0_TX1_N, PCIE0_TX1_P, PCIE0_TX2_N, PCIE0_TX2_P, PCIE0_TX3_N, PCIE0_TX3_P, USBSS0_RX_N, USBSS0_RX_P, USBSS0_TX_N, USBSS0_TX_P
differential pair; differential pair class 90DIFF: USB0_D_N, USB0_D_P, USB1_D_N, USB1_D_P
net class 100DIFF: CSI0_CLK_N, CSI0_CLK_P, CSI0_D0_N, CSI0_D0_P, CSI0_D1_N, CSI0_D1_P, CSI1_D0_N, CSI1_D0_P, CSI1_D1_N, CSI1_D1_P, CSI2_CLK_N, CSI2_CLK_P, CSI2_D0_N, CSI2_D0_P, CSI2_D1_N, CSI2_D1_P, CSI3_D0_N, CSI3_D0_P, CSI3_D1_N, CSI3_D1_P, DP1_TXD0_N, DP1_TXD0_P, DP1_TXD1_N, DP1_TXD1_P, DP1_TXD2_N, DP1_TXD2_P, DP1_TXD3_N, DP1_TXD3_P, GBE_MDI0_N, GBE_MDI0_P, GBE_MDI1_N, GBE_MDI1_P, GBE_MDI2_N, GBE_MDI2_P, GBE_MDI3_N, GBE_MDI3_P, PRE_CSI0_D1_N, PRE_CSI0_D1_P, PRE_CSI1_D0_N, PRE_CSI1_D0_P
differential pair; differential pair class 100DIFF: DP1_TXD0_N, DP1_TXD0_P, DP1_TXD1_N, DP1_TXD1_P, DP1_TXD2_N, DP1_TXD2_P, DP1_TXD3_N, DP1_TXD3_P, GBE_MDI0_N, GBE_MDI0_P, GBE_MDI1_N, GBE_MDI1_P, GBE_MDI2_N, GBE_MDI2_P, GBE_MDI3_N, GBE_MDI3_P, PRE_CSI0_D1_N, PRE_CSI0_D1_P, PRE_CSI1_D0_N, PRE_CSI1_D0_P
differential pair: DP1_AUX_N, DP1_AUX_P

### Notes on the sheet
- SODIMM CONNECTOR
- DEBUG USB + UART
- FIGURE 10-1 OF ORIN SERIES DESIGN GUIDE, POLARITY OF SOME CSI LANES IS SWAPPED ON SoC
- JUMPERS ON USBSS0 IN CASE WE WANT CAPS
- USB3_0
- ETH_0
- (near Q?#6) GATE V_TH OK
- SPI0
- UART0
- USB2_1
- (near Q?#7) GATE V_TH OK
- CAM0_MCLK
- CAM1_MCLK
- USB2_2
- UART1
- CSI_0-3
- (near R?#60) JUMPERS HERE SINCE POLARITY SWAPPED ON ORIN
- ESD PROTECTED PINS
- (near R?#59) MODULE_ID
- - I2C2 IS 1.8V DO NOT USE
  - POWER ON SEQUENCE IS IN SECTION 3 OF DATASHEET --> CARRIER BOARD MANAGES POWER, NOT JETSON
  - SPI IS 1V8 CMOS LOGIC
- SDMMC1
- I2S1
- (near MP?#4) Standoffs
- I2C2
- UART2 --> DEBUG
- nSYS_RESET indicates when carrier can power on
- PCIE_0 (4x)
- ESD PROTECTION
- (near U?#11) 32K_CLK_BUFF
- ETH ESD
- CSI ESD
- HDMI ESD
- USB ESD
- PCIE SUSPEND CLOCK BUFFER
- (near U?#12) SMB_nALERT BUFF
- PORT CHECKLIST
- BUFFER FOR SMB_ALERT BASED ON ORIN
- CAM I2C ESD
- NO JUMP HERE SINCE JUMP IN NVME SCHEM
- HDMI
- I2C_0-1
- PCIe and USBSS ESD
- SPI ESD
- MISC ESD
- CAN
- GPIO
- (near R?#71) PULLED DOWN SINCE ACTIVE LOW TO WAKE MODULE
  WON'T USE SLEEP/nWAKE BUT CONNECT TO STM AND EXPOSE
- POWER
- I2S_0
- LOOK INTO PUTTING JETSON TO SLEEP FOR SENTRY MODE ETC.
- (near Q?#10) GATE V_TH OK
- 1V8 REF LDO
- (near Q?#11) GATE V_TH OK
- SPI_1
- (near Q?#12) GATE V_TH OK
- (near U?#13) https://developer.download.nvidia.com/assets/embedded/secure/jetson/orin_nx/docs/Jetson-Orin-NX-Series-Modules-Data-Sheet_DS-10712-001_v1.1.pdf?qhjqqJOfVnHCM-1XF3yIQpd2xfOOHwmcgVwMEoYJ7MxLV6htvBcCQBAWi_BDO8yBEWslRcUaReucjDkH91McAghWwJmYjhTJoVoEUvLFgX583-qKr_REPRGUalLshQ-DeOK5XvySH5OmW4RDnQayRqIhzIBBSUWPjFaWLdJjM1JhWiyI3hM5VtWcQCIuw7hGP4sJ7ZLCMgQXeMz6eFhUxr5xiOQPPyQ1&t=eyJscyI6ImdzZW8iLCJsc2QiOiJodHRwczovL3d3dy5nb29nbGUuY29tLyJ9
- https://developer.download.nvidia.com/assets/embedded/secure/jetson/orin_nano/docs/Jetson-Orin-Nano-Series-Modules-Data-Sheet_DS-11105-001_v1.2.pdf?jdQi_j839Sjggjj5QTF3_oOgnPN2J2ewz7Km2q-aLyRAS0YMswcsS8demvG6kdssXTo3By--j94fp-O5W54ShkpP0OL6Z16cXsATsCs5kVxLQzyDWp4PJJSuB9S5pyMOEFmtw_tlPL_Gy2oPuhK_UbNdkrgh1dCA55zEuK928asFQhAHapZ0s__KiE7erU3EBWJIZ94vBC5BwytStbskK9hDtogPdFhuGCQNTg==&t=eyJscyI6ImdzZW8iLCJsc2QiOiJodHRwczovL3d3dy5nb29nbGUuY29tLyJ9
- https://resources.altium.com/p/gigabit-ethernet-101-basics-implementation
- LDO SHOULD BE OFF UNTIL JETSON BOOTS
- (near Q?#13) GATE V_TH OK
- Is there any reason ever to not use nmos level shifters?
  Current LDOs have 1V drop so my 2V_AUX reg needs to have a higher voltage. Do you know any dropin replacements that don't break the bank and have less drop? Currently have LD1117
- https://www.congatec.com/fileadmin/user_upload/Documents/Application_Notes/AN43_M.2_Pinout_Descriptions_and_Reference_Designs.pdf
- Jetson reference manual
- https://developer.download.nvidia.com/assets/embedded/secure/jetson/orin_nx/docs/DG-10931-001_v1.2.pdf?a9ej-2Bw8ItDc1cnJp_Orjmj0ruhafQwJG7pHYeyXv2gwzFspQ0ZbPaHE0IwtPv6h2NAYJaZXDoFolUZ5Iw8vU13fA-kLmHK94KlPsyvaeFIbWePzp1X10HDT7HvJCgNl1WkV_8WJp9-smZyxlSW_wKeuMdy5xgzu_0wxoi4gg==&t=eyJscyI6ImdzZW8iLCJsc2QiOiJodHRwczovL3d3dy5nb29nbGUuY29tLyJ9
- (near Q?#14) GATE V_TH OK

### Library data of the parts
C?#69 C?#70 = CMP-001-00058-1: as C1-C11 on sheet GMSL_DESERIALIZER; Min Operating Temperature: -55°C; Mounting Technology: Surface Mount; Pins: 2; Case/Package: 0402; RoHS Compliant: Yes; Max Operating Temperature: 85°C
C?#71 = CMP-2006-02792-2: Chip Multilayer Ceramic Capacitors for General Purpose, 0603, 10uF, X5R, 15%, 20%, 6.3V; Packaging: Tape and Reel; Voltage Rating (DC): 6.3V; Width: 0.031inch; Termination: SMD/SMT; Dielectric: X5R; Package Quantity: 4000; Voltage Rating: 6.3V; Capacitance: 10uF; Case/Package: 0603; Min Operating Temperature: -55°C; Voltage: 6.3V; Length: 1.6mm; Thickness: 0.035inch; Lead Free: Lead Free; Depth: 0.8mm; Case Code (Imperial): 0603; Max Operating Temperature: 85°C; Material: Ceramic; Height: 0.8mm; Tolerance: 20%; Mount: Surface Mount; REACH SVHC: No SVHC; Radiation Hardening: No; Case Code (Metric): 1608
C?#72 = CMP-2000-05393-2: Multilayer Ceramic Capacitors 100nF ±10% 50V X7R SMD 0402; Voltage: 50V; Dielectric Material: Ceramic; Min Operating Temperature: -55°C; Depth: 0.5mm; Radiation Hardening: No; RoHS Compliant: Yes; Voltage Rating (DC): 50V; Lead Free: Lead Free; Resistor Type: Ceramic; Height: 0.5mm; Dielectric: X7R; Thickness: 0.022inch; Case/Package: 0402; Case Code (Metric): 1005; Termination: SMD/SMT; Capacitance: 100nF; Packaging: Tape and Reel; Max Operating Temperature: 125°C; Mount: Surface Mount; Package Quantity: 1; Width: 0.02inch; Weight: 2.3E-05oz; Voltage Rating: 50V; Tolerance: 10%; Construction: Flat; Case Code (Imperial): 0402; Length: 1mm; REACH SVHC: No SVHC; Series: C
D?#3-D?#23 = CMP-04989-000002-1: 4-CHANNEL LOW-CAPACITANCE SURGE; Manufacturer: Texas Instruments; Value: 0.55pF; Reverse Standoff Voltage: 3.6V; Standoff Height: 0mm; Breakdown Voltage: 5.5V; Peak Pulse Current: 5.5A; Clamping Voltage: 11.5V; Direction: Bidirectional; Peak Pulse Power: 50W; Number Of Channels: 4; Ambient Temperature Range High: +125°C; ComponentLink2Description: Datasheet; Height: 0.55mm; Lead Free: Yes; Device Class L3: unset; Temperature Range High: +125°C; Temperature Range Low: -40°C; Package: DQA0010A; Temperature: -40°C to +125°C; Capacitance: 0.55pF; RoHS: TRUE; Mouser Description: 4-Channel Low-Capacitance Surge and ESD Protection Diode 10-USON -40 to 125; Category: Diode; Device Class L1: Circuit Protection; Octopart: https://octopart.com/esd204dqar-texas+instruments-89917476; Device Class L2: TVS Diodes; Ambient Temperature Range Low: -40°C; Manufacturer Part Number: ESD204DQAR; ComponentLink2URL: http://www.ti.com/lit/ds/symlink/esd204.pdf; Automotive: No; Digikey Description: 4-CHANNEL LOW-CAPACITANCE SURGE
J?#16-J?#23 = CMP-03356-000001-1: DDR4 SODIMM 260P 9.2H STD; Manufacturer: TE Connectivity; Voltage Rating: 25V; Current Rating: 0.5A; Is Female: yes; Pitch: 0.5mm; Memory Type: SDRAM,DDR; Conn Orientation: Horizontal; Number Of Contacts: 260; Temperature: -55°C to +85°C; Octopart: https://octopart.com/2309413-1-te+connectivity-84799194; Device Class L3: unset; Contact Material: Gold,Nickel; ComponentLink2URL: https://www.te.com/commerce/DocumentDelivery/DDEController?Action=showdoc&DocId=Specification+Or+Standard%7F108-115122%7FA1%7Fpdf%7FEnglish%7FENG_SS_108-115122_A1.pdf%7F2309413-1; Manufacturer Part Number: 2309413-1; ComponentLink2Description: Datasheet; Digikey Description: DDR4 SODIMM 260P 9.2H STD; Height: 18.8mm; Footprint Url: https://www.te.com/commerce/DocumentDelivery/DDEController?Action=showdoc&DocId=Customer+Drawing%7F2309413%7F4%7Fpdf%7FEnglish%7FENG_CD_2309413_4.pdf%7F2309413-1; Temperature Range Low: -55°C; Device Class L2: Memory Connectors; Temperature Range High: +85°C; RoHS: TRUE; Automotive: No; Device Class L1: Connectors; Mouser Description: Conn DDR4 DIMM Socket SKT 260 POS 0.5mm Solder RA SMD T/R; Category: Conn; Package: 0; Lead Free: Yes
J?#24 = CMP-02766-001428-1: CONN HEADER VERT 2POS 2.54MM; Voltage Rating: 550V; Current Rating: 7.6A; Gender: Male; Number of Contacts: 2; Connector Type: Male Pin; Radiation Hardening: No; Orientation: Straight; Contact Plating: Gold; Max Operating Temperature: 125°C; Mount: Through Hole; Package Quantity: 1; Number of Rows: 1; Housing Material: Polyester; RoHS Compliant: Yes; Length: 5.08mm; Max Voltage Rating (AC): 550V; Pitch: 2.54mm; Packaging: Bulk; Depth: 2.54mm; Termination: Solder; Min Operating Temperature: -55°C; Housing Color: Black; Lead Free: Lead Free; Color: Black; Number of Positions: 2; Width: 2.54mm; Max Current Rating: 7.6A; REACH SVHC: No SVHC; Contact Material: Bronze; Contact Mating Length: 0.23inch; Series: TSW; Contact Type: Male Pin
MP?#4 MP?#5 = CMP-03913-59774857-1: 9774025243R Spacer Material: Steel, Tin-Plated Mounting: SMT Series: WA-SMST Thread D: M2; Outside Diameter: 4.3434mm; Threaded/Unthreaded: Threaded; Plating: Tin; REACH SVHC: Unknown; NexarPartId: 59774857; RoHS: Compliant; Material: Steel; Packaging: Tape and Reel; Max Operating Temperature: 150°C; Min Operating Temperature: -55°C; Length: 2.5mm; Height: 2.5mm
Q?#6 Q?#7 Q?#10-Q?#14 = CMP-2000-05968-1: N-Channel Enhancement Mode Mosfet, 50 V, 200 mA, -55 to 150 degC, 6-Pin SOT-323, RoHS, Tape and Reel; Typical Turn-Off Delay Time: 20ns; Number of Channels: 1Channel; Type: EnhancementModeFieldEffectTransistor; Brand: DiodesIncorporated; Vds - Drain-Source Breakdown Voltage: 75V; Vgs - Gate-Source Voltage: 20V; Rds On - Drain-Source Resistance: 1.4Ohms; Transistor Type: 1N-Channel; Configuration: Single; Unit Weight: 0.000212oz; Pd - Power Dissipation: 200mW; Id - Continuous Drain Current: 200mA; Forward Transconductance - Min: 0.1S; Manufacturer URL: http://www.diodes.com/; Series: BSS138; Package Description: 3-Pin Small Outline Transistor, Body 2 x 1.25 mm, Pitch 0.65 mm; Mounting Technology: SurfaceMount; Product Category: MOSFET; RoHS: True; Maximum Operating Temperature: +150C; Height: 1mm; Length: 2.2mm; Technology: Si; Width: 1.35mm; Datasheet URL: http://www.diodes.com/_files/datasheets/ds30206.pdf; Manufacturer: DiodesIncorporated; Package / Case: SOT-323-3; Typical Turn-On Delay Time: 20ns; Transistor Polarity: N-Channel; Factory Pack Quantity: 3000; Packaging: Reel; Product: MOSFETSmallSignal; Datasheet Version: Rev. 11-2, 09/2013; Package Reference: SOT323; Minimum Operating Temperature: -55C; Mounting Style: SMD/SMT; Channel Mode: Enhancement
Q?#8 Q?#9 = CMP-35916-000009-1: MOSFET 2N-CH 60V 0.3A; Input Capacitance: 40pF; Continuous Drain Current (ID): 300mA; Max Power Dissipation: 285mW; FET Type: 2 N-Channel; Rds On Max: 1.5R; Mount: Surface Mount; Drain to Source Voltage (Vdss): 60V; Packaging: Tape and Reel
R?#53 R?#54 R?#56 R?#57 R?#68-R?#70 R?#73 R?#74 R?#76 R?#77 R?#79 R?#80 R?#82 R?#83 R?#85 R?#86 = CMP-1012-00623-3: Chip Resistor, 10 KOhm, +/- 1%, 0.1 W, -55 to 155 degC, 0603 (1608 Metric), RoHS, Tape and Reel; Manufacturer: Panasonic; Voltage Rating: 75V; Case\/Package: 0603; Power Rating: 100mW; Resistance: 10KOhm; Temperature Coefficient: 100ppm\/degreesC; Number of Pins: 2; Package Reference: 603; Depth: 0.8mm; Mount: SurfaceMount; Package Description: 2-Pin Surface Mount Device, Body 1.6 x 0.85 mm; Datasheet Version: 02/2017; Length: 1.6mm; Lead Free: LeadFree; Height: 0.45mm; Number of Terminations: 2; Max Power Dissipation: 100mW; Min Operating Temperature: -55degC; Datasheet URL: https://industrial.panasonic.com/cdbs/www-data/pdf/RDA0000/AOA0000C304.pdf; Termination: SMD/SMT; Case Code (Metric): 1608; Case Code (Imperial): 0603; Tolerance: 1%; Max Operating Temperature: 155degC; RoHSCompliant: true; Voltage Rating (DC): 75V; Radiation Hardening: No; Packaging: TapeandReel; Composition: ThickFilm; Mounting Technology: SurfaceMount; Manufacturer URL: http://www.panasonic.com/; Width: 0.031inch; REACH SVHC: NoSVHC; Contact Plating: Tin; Military Standard: Not; Package Quantity: 1
R?#55 R?#58 R?#64 R?#65 R?#75 R?#78 R?#81 R?#84 R?#87 = CMP-2000-00180-1: Manufacturer: Panasonic; Part Number: ERJ-3EKF1001V
R?#59-R?#63 = CMP-009-00118-2: READ THE NAME; Pins: 2; Component Type: Standard; Design Item ID: CMP-009-00206-2; Source: 0402jump.SchLib
R?#66 R?#67 R?#71 R?#72 = CMP-2000-00182-1: Manufacturer: Panasonic; Part Number: ERJ-3EKF1003V
TP?#4-TP?#8 = CMP-00025-2: Test Point .6mm
U?#11 U?#12 = CMP-0859-00290-4: IC BUFF/DVR NON-INVERT SC70-5; Number of Output Lines: 1; Turn-On Delay Time: 8.3ns; Min Supply Voltage: 1.65V; Polarity: Non-Inverting; Quiescent Current: 10uA; Low Level Output Current: 32mA; Nominal Supply Current: 40mA; Logic Function: Buffer; Max Supply Voltage: 5.5V; Number of Bits: 1; Number of Circuits: 1; Contact Plating: Gold; Max Operating Temperature: 125°C; Package Quantity: 1; Number of Channels: 1; Number of Outputs: 1; Case/Package: SC; Number of Gates: 1; Number of Pins: 5; Radiation Hardening: No; Min Operating Temperature: -40°C; Number of Bits per Element: 1; Lead Free: Lead Free; High Level Output Current: 32mA; Number of Input Lines: 1; Number of Inputs: 1; Propagation Delay: 8.3ns; Number of Elements: 1; Packaging: Tape and Reel; Mount: Surface Mount; Termination: SMD/SMT; REACH SVHC: No SVHC
U?#13 = CMP-0244-00308-1: Fixed Low Drop Positive Voltage Regulator, 1.8V, 4-Pin SOT-223, Tape and Reel; ComponentLink1URL: http://www.st.com; PackageReference: SOT-223; PackageDescription: 4-Pin SOT-223 Package, 6.5 x 3.5 mm Body, 2.3 mm Pitch, 7 mm Lead Span; ComponentLink2URL: http://www.st.com/internet/com/TECHNICAL_RESOURCES/TECHNICAL_LITERATURE/DATASHEET/CD00000544.pdf; ComponentLink2Description: Datasheet; ComponentLink1Description: Manufacturer URL; DatasheetVersion: 1/11/2011; PackageVersion: 2010

## Nets that join several sheets
5V_MAIN: MAIN_BOARD (R?#4.1), RAIL_DISCH_0 (R?_RAIL_DISCH_0#2.2), RAIL_DISCH_1 (R?_RAIL_DISCH_1#2.2), RAIL_DISCH_2 (R?_RAIL_DISCH_2#2.2), JETSON (12 pins)
DES_3V3: DES_1 (11 pins), DES_0 (11 pins)
GND: MAIN_BOARD (112 pins), JETSON_V2 (82 pins), NVME (33 pins), RAIL_DISCH_0 (Q?_RAIL_DISCH_0#1.4 Q?_RAIL_DISCH_0#2.1), RAIL_DISCH_1 (Q?_RAIL_DISCH_1#1.4 Q?_RAIL_DISCH_1#2.1), RAIL_DISCH_2 (Q?_RAIL_DISCH_2#1.4 Q?_RAIL_DISCH_2#2.1), DES_1 (43 pins), DES_0 (43 pins), HDMI_TO_GMSL (U?#8.57), HD3SS215_PINOUT (35 pins), JETSON (126 pins)
RAIL: MAIN_BOARD (Q?#1.5 Q?#1.6 R?#1.2), JETSON_V2 (18 pins), NVME (F?.1), RAIL_DISCH_1 (R?_RAIL_DISCH_1#1.2), DES_1 (F5_DES_1.1), DES_0 (F5_DES_0.1), JETSON (6 pins)
RAIL: JETSON_V2 (C?#28.2 U?#1.3), RAIL_DISCH_2 (R?_RAIL_DISCH_2#1.2), JETSON (C?#72.2 U?#13.3)
PoC_A: MAIN_BOARD (J2.2), DES_1 (C1_DES_1.2 D1_DES_1.1 D1_DES_1.10 L3_DES_1.2)
PoC_A: MAIN_BOARD (J1.2), DES_0 (C1_DES_0.2 D1_DES_0.1 D1_DES_0.10 L3_DES_0.2)
PoC_B: MAIN_BOARD (J2.1), DES_1 (C2_DES_1.2 D1_DES_1.5 D1_DES_1.6 L6_DES_1.2)
PoC_B: MAIN_BOARD (J1.1), DES_0 (C2_DES_0.2 D1_DES_0.5 D1_DES_0.6 L6_DES_0.2)
PoC_C: MAIN_BOARD (J2.4), DES_1 (C5_DES_1.2 D2_DES_1.1 D2_DES_1.10 L12_DES_1.2)
PoC_C: MAIN_BOARD (J1.4), DES_0 (C5_DES_0.2 D2_DES_0.1 D2_DES_0.10 L12_DES_0.2)
PoC_D: MAIN_BOARD (J2.3), DES_1 (C6_DES_1.2 D2_DES_1.5 D2_DES_1.6 L9_DES_1.2)
PoC_D: MAIN_BOARD (J1.3), DES_0 (C6_DES_0.2 D2_DES_0.5 D2_DES_0.6 L9_DES_0.2)